# Altium project led-PCB_Project.PrjPcb
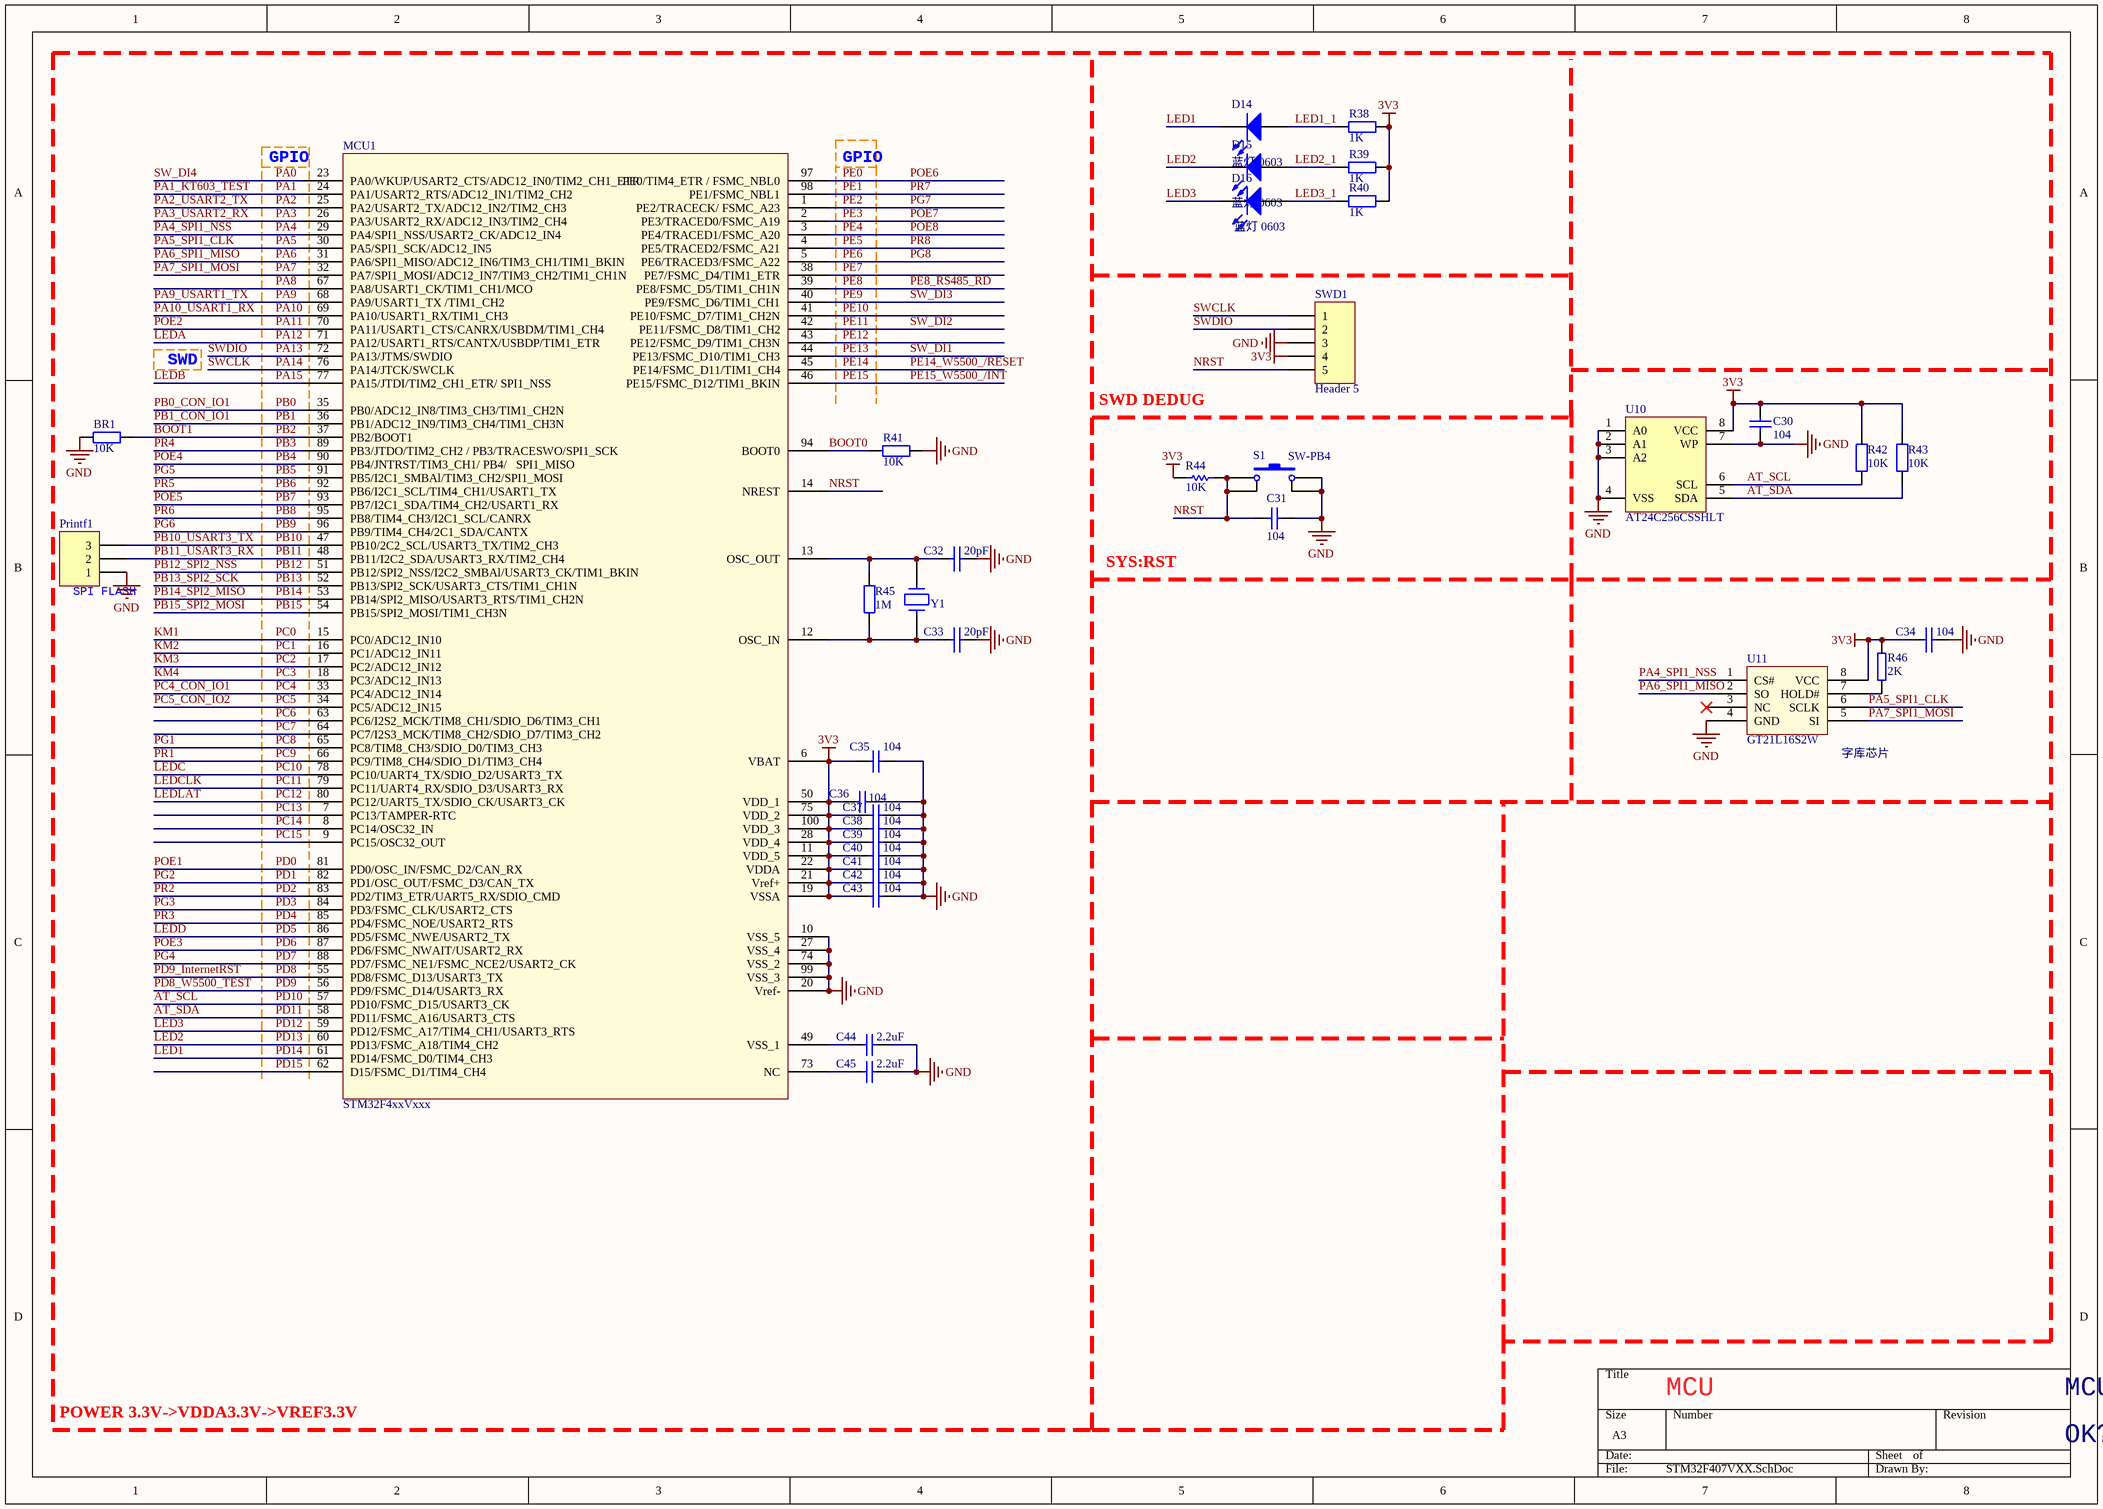
[diagram p0: STM32F407VXX.SchDoc]
8 sheets, 303 parts. Net scope: global (net labels, ports and power ports of the same name join across sheets).
Board file: LH_Traffic_Light(XP)_V2.2_20171103-1500pm.PcbDoc
Sheets:
  STM32F407VXX.SchDoc
  W5500.SchDoc
  FOUR-INPORT.SchDoc
  LED-12PORT.SchDoc
  RS485.SchDoc
  KT403A1.SchDoc
  TWO_OUTPORT.SchDoc
  POWER.SchDoc

## Sheet STM32F407VXX.SchDoc
size A3

### Parts
(Parts that share a designator on the sheet are numbered #1, #2 ... from top to bottom, then left to right.)
BR1  10K  [LC-0603_R]
C30  104  [LC-0603_C]
C31  104  [LC-0603_C]
C32  20pF  [LC-0603_C]
C33#1  20pF  [LC-0603_C]
C34  104  [LC-0603_C]
C35#1  104  [LC-0603_C]
C36#1  104  [LC-0603_C]
C37#1  104  [LC-0603_C]
C38  104  [LC-0603_C]
C39  104  [LC-0603_C]
C40  104  [LC-0603_C]
C41  104  [LC-0603_C]
C42  104  [LC-0603_C]
C43  104  [LC-0603_C]
C44  2.2uF  [LC-0603_C]
C45  2.2uF  [LC-0603_C]
D14  蓝灯 0603  [LC-0603_LED_S1]
D15  蓝灯 0603  [LC-0603_LED_S1]
D16  蓝灯 0603  [LC-0603_LED_S1]
MCU1  STM32F4xxVxxx  [LC-QFP-100_14x14x05P]
Printf1  Printf  [F2.54-3P]  (value not drawn)
R38#1  1K  [LC-0603_R]
R39  1K  [LC-0603_R]
R40  1K  [LC-0603_R]
R41  10K  [LC-0603_R]
R42  10K  [LC-0603_R]
R43  10K  [LC-0603_R]
R44  10K  [LC-0603_R]
R45  1M  [LC-0603_R]
R46  2K  [LC-0603_R]
S1  SW-PB4  [SW_PB4_A1]
SWD1  Header 5  [F2.54-5P]
U10  AT24C256CSSHLT  [SOIC-8]
U11  GT21L16S2W  [SOIC-8W]
Y1  25MHz  [LC-HC-49SMD]  (value not drawn)

### Nets
3V3: C30.1 C34.2 C35#1.1 C36#1.1 C37#1.1 C38.1 C39.1 C40.1 C41.1 C42.1 C43.1 MCU1.6(VBAT) MCU1.11(VDD_5) MCU1.19(VSSA) MCU1.21(Vref+) MCU1.22(VDDA) MCU1.28(VDD_4) MCU1.50(VDD_1) MCU1.75(VDD_2) MCU1.100(VDD_3) R38#1.1 R39.1 R40.1 R42.1 R43.1 R44.2 R46.1 SWD1.4 U10.8(VCC) U11.8(VCC)
GND: BR1.1 C30.2 C31.1 C32.2 C33#1.2 C34.1 C35#1.2 C36#1.2 C37#1.2 C38.2 C39.2 C40.2 C41.2 C42.2 C43.2 C44.2 C45.2 MCU1.10(VSS_5) MCU1.20(Vref-) MCU1.27(VSS_4) MCU1.74(VSS_2) MCU1.99(VSS_3) Printf1.1 R41.1 S1.2 S1.3 SWD1.3 U10.1(A0) U10.2(A1) U10.3(A2) U10.4(VSS) U10.7(WP) U11.4(GND)
AT_SCL: MCU1.57(PD10/FSMC_D15/USART3_CK) R42.2 U10.6(SCL)  [also labelled PD10]
AT_SDA: MCU1.58(PD11/FSMC_A16/USART3_CTS) R43.2 U10.5(SDA)  [also labelled PD11]
BOOT0: MCU1.94(BOOT0) R41.2
BOOT1: BR1.2 MCU1.37(PB2/BOOT1)  [also labelled PB2]
KM1: MCU1.15(PC0/ADC12_IN10)  [also labelled PC0]
KM2: MCU1.16(PC1/ADC12_IN11)  [also labelled PC1]
KM3: MCU1.17(PC2/ADC12_IN12)  [also labelled PC2]
KM4: MCU1.18(PC3/ADC12_IN13)  [also labelled PC3]
LED1: D14.K MCU1.61(PD14/FSMC_D0/TIM4_CH3)  [also labelled PD14]
LED1_1: D14.A R38#1.2
LED2: D15.K MCU1.60(PD13/FSMC_A18/TIM4_CH2)  [also labelled PD13]
LED2_1: D15.A R39.2
LED3: D16.K MCU1.59(PD12/FSMC_A17/TIM4_CH1/USART3_RTS)  [also labelled PD12]
LED3_1: D16.A R40.2
LEDA: MCU1.71(PA12/USART1_RTS/CANTX/USBDP/TIM1_ETR)  [also labelled PA12]
LEDB: MCU1.77(PA15/JTDI/TIM2_CH1_ETR/_SPI1_NSS)  [also labelled PA15]
LEDC: MCU1.78(PC10/UART4_TX/SDIO_D2/USART3_TX)  [also labelled PC10]
LEDCLK: MCU1.79(PC11/UART4_RX/SDIO_D3/USART3_RX)  [also labelled PC11]
LEDD: MCU1.86(PD5/FSMC_NWE/USART2_TX)  [also labelled PD5]
LEDLAT: MCU1.80(PC12/UART5_TX/SDIO_CK/USART3_CK)  [also labelled PC12]
NRST: C31.2 MCU1.14(NREST) R44.1 S1.1 S1.4 SWD1.5
PA0: MCU1.23(PA0/WKUP/USART2_CTS/ADC12_IN0/TIM2_CH1_ETR)  [also labelled SW_DI4]
PA1: MCU1.24(PA1/USART2_RTS/ADC12_IN1/TIM2_CH2)  [also labelled PA1_KT603_TEST]  [project net KT603_TEST]
PA2: MCU1.25(PA2/USART2_TX/ADC12_IN2/TIM2_CH3)  [also labelled PA2_USART2_TX]  [project net MP3_RX]
PA3: MCU1.26(PA3/USART2_RX/ADC12_IN3/TIM2_CH4)  [also labelled PA3_USART2_RX]  [project net MP3_TX]
PA4: MCU1.29(PA4/SPI1_NSS/USART2_CK/ADC12_IN4) U11.1(CS#)  [also labelled PA4_SPI1_NSS]
PA5: MCU1.30(PA5/SPI1_SCK/ADC12_IN5) U11.6(SCLK)  [also labelled PA5_SPI1_CLK]
PA6: MCU1.31(PA6/SPI1_MISO/ADC12_IN6/TIM3_CH1/TIM1_BKIN) U11.2(SO)  [also labelled PA6_SPI1_MISO]
PA7: MCU1.32(PA7/SPI1_MOSI/ADC12_IN7/TIM3_CH2/TIM1_CH1N) U11.5(SI)  [also labelled PA7_SPI1_MOSI]
PA8: MCU1.67(PA8/USART1_CK/TIM1_CH1/MCO)
PA9: MCU1.68(PA9/USART1_TX_/TIM1_CH2)  [also labelled PA9_USART1_TX]
PA10: MCU1.69(PA10/USART1_RX/TIM1_CH3)  [also labelled PA10_USART1_RX]
PA11: MCU1.70(PA11/USART1_CTS/CANRX/USBDM/TIM1_CH4)  [also labelled POE2]
PA13: MCU1.72(PA13/JTMS/SWDIO) SWD1.2  [also labelled SWDIO]
PA14: MCU1.76(PA14/JTCK/SWCLK) SWD1.1  [also labelled SWCLK]
PB0: MCU1.35(PB0/ADC12_IN8/TIM3_CH3/TIM1_CH2N)  [also labelled PB0_CON_IO1]  [project net CON_IO3]
PB1: MCU1.36(PB1/ADC12_IN9/TIM3_CH4/TIM1_CH3N)  [also labelled PB1_CON_IO1]  [project net CON_IO4]
PB3: MCU1.89(PB3/JTDO/TIM2_CH2_/_PB3/TRACESWO/SPI1_SCK)  [also labelled PR4]
PB4: MCU1.90(PB4/JNTRST/TIM3_CH1/_PB4/___SPI1_MISO)  [also labelled POE4]
PB5: MCU1.91(PB5/I2C1_SMBAl/TIM3_CH2/SPI1_MOSI)  [also labelled PG5]
PB6: MCU1.92(PB6/I2C1_SCL/TIM4_CH1/USART1_TX)  [also labelled PR5]
PB7: MCU1.93(PB7/I2C1_SDA/TIM4_CH2/USART1_RX)  [also labelled POE5]
PB8: MCU1.95(PB8/TIM4_CH3/I2C1_SCL/CANRX)  [also labelled PR6]
PB9: MCU1.96(PB9/TIM4_CH4/2C1_SDA/CANTX)  [also labelled PG6]
PB10: MCU1.47(PB10/2C2_SCL/USART3_TX/TIM2_CH3) Printf1.3  [also labelled PB10_USART3_TX]
PB11: MCU1.48(PB11/I2C2_SDA/USART3_RX/TIM2_CH4) Printf1.2  [also labelled PB11_USART3_RX]
PB12: MCU1.51(PB12/SPI2_NSS/I2C2_SMBAl/USART3_CK/TIM1_BKIN)  [also labelled PB12_SPI2_NSS]  [project net /SPI_SCS]
PB13: MCU1.52(PB13/SPI2_SCK/USART3_CTS/TIM1_CH1N)  [also labelled PB13_SPI2_SCK]
PB14: MCU1.53(PB14/SPI2_MISO/USART3_RTS/TIM1_CH2N)  [also labelled PB14_SPI2_MISO]
PB15: MCU1.54(PB15/SPI2_MOSI/TIM1_CH3N)  [also labelled PB15_SPI2_MOSI]
PC4: MCU1.33(PC4/ADC12_IN14)  [also labelled PC4_CON_IO1]  [project net CON_IO1]
PC5: MCU1.34(PC5/ADC12_IN15)  [also labelled PC5_CON_IO2]  [project net CON_IO2]
PC6: MCU1.63(PC6/I2S2_MCK/TIM8_CH1/SDIO_D6/TIM3_CH1)
PC7: MCU1.64(PC7/I2S3_MCK/TIM8_CH2/SDIO_D7/TIM3_CH2)
PC8: MCU1.65(PC8/TIM8_CH3/SDIO_D0/TIM3_CH3)  [also labelled PG1]
PC9: MCU1.66(PC9/TIM8_CH4/SDIO_D1/TIM3_CH4)  [also labelled PR1]
PC13: MCU1.7(PC13/TAMPER-RTC)
PC14: MCU1.8(PC14/OSC32_IN)
PC15: MCU1.9(PC15/OSC32_OUT)
PD0: MCU1.81(PD0/OSC_IN/FSMC_D2/CAN_RX)  [also labelled POE1]
PD1: MCU1.82(PD1/OSC_OUT/FSMC_D3/CAN_TX)  [also labelled PG2]
PD2: MCU1.83(PD2/TIM3_ETR/UART5_RX/SDIO_CMD)  [also labelled PR2]
PD3: MCU1.84(PD3/FSMC_CLK/USART2_CTS)  [also labelled PG3]
PD4: MCU1.85(PD4/FSMC_NOE/USART2_RTS)  [also labelled PR3]
PD6: MCU1.87(PD6/FSMC_NWAIT/USART2_RX)  [also labelled POE3]
PD7: MCU1.88(PD7/FSMC_NE1/FSMC_NCE2/USART2_CK)  [also labelled PG4]
PD8: MCU1.55(PD8/FSMC_D13/USART3_TX)  [also labelled PD9_InternetRST]  [project net InternetRST]
PD8_W5500_TEST: MCU1.56(PD9/FSMC_D14/USART3_RX)  [also labelled PD9]
PD15: MCU1.62(D15/FSMC_D1/TIM4_CH4)
PE0: MCU1.97(PE0/TIM4_ETR_/_FSMC_NBL0)  [also labelled POE6]
PE1: MCU1.98(PE1/FSMC_NBL1)  [also labelled PR7]
PE2: MCU1.1(PE2/TRACECK/_FSMC_A23)  [also labelled PG7]
PE3: MCU1.2(PE3/TRACED0/FSMC_A19)  [also labelled POE7]
PE4: MCU1.3(PE4/TRACED1/FSMC_A20)  [also labelled POE8]
PE5: MCU1.4(PE5/TRACED2/FSMC_A21)  [also labelled PR8]
PE6: MCU1.5(PE6/TRACED3/FSMC_A22)  [also labelled PG8]
PE7: MCU1.38(PE7/FSMC_D4/TIM1_ETR)
PE8: MCU1.39(PE8/FSMC_D5/TIM1_CH1N)  [also labelled PE8_RS485_RD]
PE9: MCU1.40(PE9/FSMC_D6/TIM1_CH1)  [also labelled SW_DI3]
PE10: MCU1.41(PE10/FSMC_D7/TIM1_CH2N)
PE11: MCU1.42(PE11/FSMC_D8/TIM1_CH2)  [also labelled SW_DI2]
PE12: MCU1.43(PE12/FSMC_D9/TIM1_CH3N)
PE13: MCU1.44(PE13/FSMC_D10/TIM1_CH3)  [also labelled SW_DI1]
PE14: MCU1.45(PE14/FSMC_D11/TIM1_CH4)  [also labelled PE14_W5500_/RESET]  [project net /RESET]
PE15: MCU1.46(PE15/FSMC_D12/TIM1_BKIN)  [also labelled PE15_W5500_/INT]  [project net /INT]
NetC32_1: C32.1 MCU1.13(OSC_OUT) R45.2 Y1.2
NetC33#1_1: C33#1.1 MCU1.12(OSC_IN) R45.1 Y1.1
NetC44_1: C44.1 MCU1.49(VSS_1)
NetC45_1: C45.1 MCU1.73(NC)
NetR46_2: R46.2 U11.7(HOLD#)

Not connected (* = marked no-connect by the designer): U11 3(NC)*

### Notes on the sheet
- (near MCU1) GPIO
- GPIO
- SWD
- SWD DEDUG
- SYS:RST
- (near Printf1) SPI FLASH
- (near U11) 字库芯片
- MCU
- MCU板
- POWER 3.3V->VDDA3.3V->VREF3.3V
- OK?V1.0.0

### Library data of the parts
BR1 R38#1 R39-R43 R45 = Res2: Resistor; Published: 8-Jun-2000; LatestRevisionDate: 17-Jul-2002; LatestRevisionNote: Re-released for DXP Platform.; PackageReference: AXIAL-0.4; Publisher: Altium Limited
  BR1 R41-R43: Value: 10K
  R38#1 R39 R40: Value: 1K
  R45: Value: 1M
C30 C31 C35#1 C36#1 C37#1 C38-C43 = CAP: Capacitor; Value: 100nF; Published: 8-Jun-2000; Revision: July-2002: Re-released for DXP Platform.; Publisher: Altium Limited
C32 C33#1 C44 C45 = CAP: Capacitor
  C44 C45: Published: 8-Jun-2000; Revision: July-2002: Re-released for DXP Platform.; Publisher: Altium Limited; Value: 2.2uF
C34 = C
D14-D16 = 0603 蓝灯: 发光二极管; ComponentLink1Description: 供应商链接; ComponentLink1URL: http://www.szlcsc.com/product/details_73150.html; Package: 0603; Supplier: LC; SuppliersPartNumber: C72041
MCU1 = STM32F103VET6
Printf1 = Header 3H: Header, 3-Pin, Right Angle; LatestRevisionDate: 17-Jul-2002; LatestRevisionNote: Re-released for DXP Platform.; Publisher: Altium Limited
R44 = res1: Resistor; Published: 8-Jun-2000; Revision: July-2002: Re-released for DXP Platform.; Publisher: Altium Limited; Value: 10K
R46 = RES2
S1 = SW-PB4: 微动开关; Published: 24-Mar-1999; LatestRevisionDate: 17-Jul-2002; LatestRevisionNote: Re-released for DXP Platform.; PackageReference: SPST-2; Publisher: Altium Limited
SWD1 = Header 5: Header, 5-Pin; LatestRevisionDate: 17-Jul-2002; LatestRevisionNote: Re-released for DXP Platform.; Publisher: Altium Limited
U10 = AT2: EEROM存储器
U11 = GT21L16S
Y1 = CRYSTAL

## Sheet W5500.SchDoc
size A4
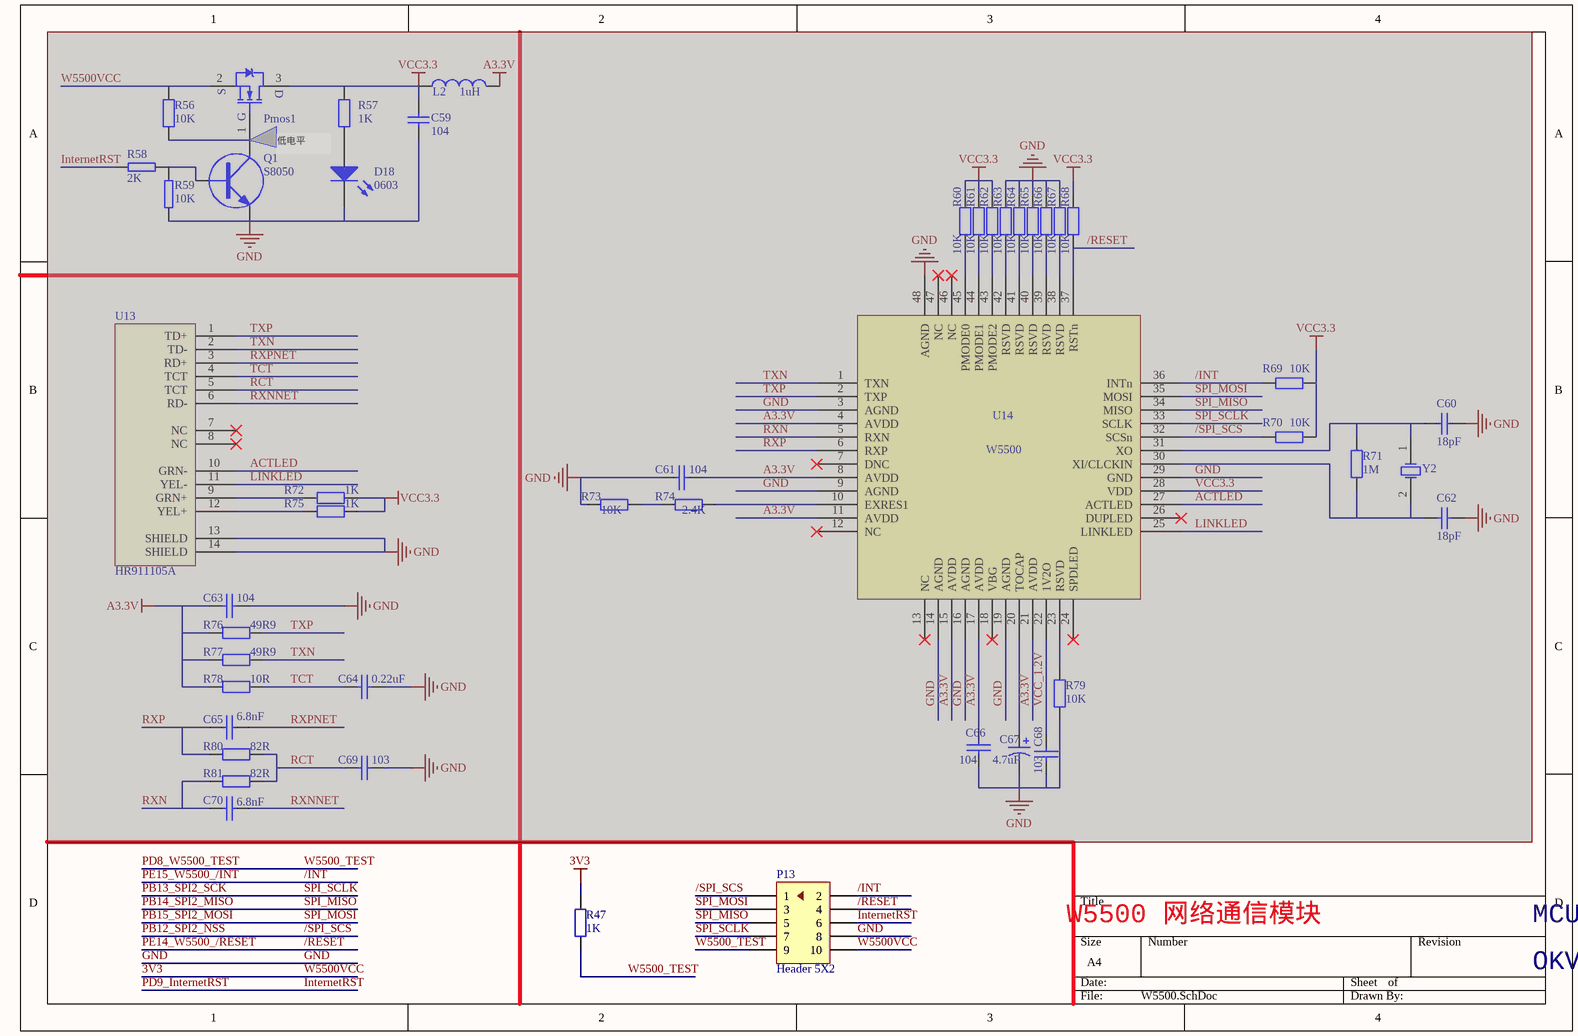
[diagram p1: W5500.SchDoc]

### Parts
(Parts that share a designator on the sheet are numbered #1, #2 ... from top to bottom, then left to right.)
C59  104  [LC-0603_C]  (masked out: inside a compile mask, not in the netlist)
C60  18pF  [LC-0603_C]  (masked out: inside a compile mask, not in the netlist)
C61  104  [LC-0603_C]  (masked out: inside a compile mask, not in the netlist)
C62  18pF  [LC-0603_C]  (masked out: inside a compile mask, not in the netlist)
C63  104  [LC-0603_C]  (masked out: inside a compile mask, not in the netlist)
C64  0.22uF  [LC-0603_C]  (masked out: inside a compile mask, not in the netlist)
C65  6.8nF  [LC-0603_C]  (masked out: inside a compile mask, not in the netlist)
C66  104  [LC-0603_C]  (masked out: inside a compile mask, not in the netlist)
C67  4.7uF  [LC-CASE-R_2012]  (masked out: inside a compile mask, not in the netlist)
C68  103  [LC-0603_C]  (masked out: inside a compile mask, not in the netlist)
C69  103  [LC-0603_C]  (masked out: inside a compile mask, not in the netlist)
C70  6.8nF  [LC-0603_C]  (masked out: inside a compile mask, not in the netlist)
D18#1  0603  [LC-0603_LED_S1]  (masked out: inside a compile mask, not in the netlist)
L2  1uH  [LC-0805_L]  (masked out: inside a compile mask, not in the netlist)
P13  Header 5X2  [HDR5X2-2.54]
Pmos1  SI2301  [LC-SOT-23(SOT-23-3)]  (value not drawn)  (masked out: inside a compile mask, not in the netlist)
Q1#1  S8050  [LC-SOT-23(SOT-23-3)]  (masked out: inside a compile mask, not in the netlist)
R47  1K  [R0603]
R56#1  10K  [LC-0603_R]  (masked out: inside a compile mask, not in the netlist)
R57#1  1K  [LC-0603_R]  (masked out: inside a compile mask, not in the netlist)
R58#1  2K  [LC-0603_R]  (masked out: inside a compile mask, not in the netlist)
R59#1  10K  [LC-0603_R]  (masked out: inside a compile mask, not in the netlist)
R60#1  10K  [LC-0603_R]  (masked out: inside a compile mask, not in the netlist)
R61#1  10K  [LC-0603_R]  (masked out: inside a compile mask, not in the netlist)
R62#1  10K  [LC-0603_R]  (masked out: inside a compile mask, not in the netlist)
R63#1  10K  [LC-0603_R]  (masked out: inside a compile mask, not in the netlist)
R64  10K  [LC-0603_R]  (masked out: inside a compile mask, not in the netlist)
R65  10K  [LC-0603_R]  (masked out: inside a compile mask, not in the netlist)
R66  10K  [LC-0603_R]  (masked out: inside a compile mask, not in the netlist)
R67  10K  [LC-0603_R]  (masked out: inside a compile mask, not in the netlist)
R68  10K  [LC-0603_R]  (masked out: inside a compile mask, not in the netlist)
R69  10K  [LC-0603_R]  (masked out: inside a compile mask, not in the netlist)
R70  10K  [LC-0603_R]  (masked out: inside a compile mask, not in the netlist)
R71  1M  [LC-0603_R]  (masked out: inside a compile mask, not in the netlist)
R72  1K  [LC-0603_R]  (masked out: inside a compile mask, not in the netlist)
R73  10K  [LC-0603_R]  (masked out: inside a compile mask, not in the netlist)
R74  2.4K  [LC-0603_R]  (masked out: inside a compile mask, not in the netlist)
R75  1K  [LC-0603_R]  (masked out: inside a compile mask, not in the netlist)
R76  49R9  [LC-0603_R]  (masked out: inside a compile mask, not in the netlist)
R77  49R9  [LC-0603_R]  (masked out: inside a compile mask, not in the netlist)
R78  10R  [LC-0603_R]  (masked out: inside a compile mask, not in the netlist)
R79  10K  [LC-0603_R]  (masked out: inside a compile mask, not in the netlist)
R80  82R  [LC-0603_R]  (masked out: inside a compile mask, not in the netlist)
R81  82R  [LC-0603_R]  (masked out: inside a compile mask, not in the netlist)
U13  HR911105A  [HR911105A]  (masked out: inside a compile mask, not in the netlist)
U14  W5500  [LQFP48]  (masked out: inside a compile mask, not in the netlist)
Y2  25MHz  [LC-HC-49SMD]  (value not drawn)  (masked out: inside a compile mask, not in the netlist)

### Nets
3V3: P13.10 R47.1  [also labelled W5500VCC]
GND: P13.8
/INT: P13.2  [also labelled PE15_W5500_/INT]
/RESET: P13.4  [also labelled PE14_W5500_/RESET]
/SPI_SCS: P13.1  [also labelled PB12_SPI2_NSS]
InternetRST: P13.6  [also labelled PD9_InternetRST]
PB13_SPI2_SCK: P13.7  [also labelled SPI_SCLK]  [project net PB13]
PB14_SPI2_MISO: P13.5  [also labelled SPI_MISO]  [project net PB14]
PB15_SPI2_MOSI: P13.3  [also labelled SPI_MOSI]  [project net PB15]
PD8_W5500_TEST: P13.9 R47.2  [also labelled W5500_TEST]

### Notes on the sheet
- 低电平
- W5500 网络通信模块
- MCU板
- OKV0.0.0

### Library data of the parts
C59 C60 C62 = Cap: Capacitor; Published: 8-Jun-2000; LatestRevisionDate: 17-Jul-2002; LatestRevisionNote: Re-released for DXP Platform.; PackageReference: RAD-0.3; Publisher: Altium Limited
  C59: Value: 104
  C60 C62: Value: 18pF
C61 C63-C66 C68-C70 = CAP: Capacitor
C67 = Cap Pol3: Polarized Capacitor (Surface Mount); Published: 8-Jun-2000; LatestRevisionDate: 17-Jul-2002; LatestRevisionNote: Re-released for DXP Platform.; PackageReference: C0805; Publisher: Altium Limited; Value: 4.7uF
D18#1 = 0: 发光二极管; ComponentLink1Description: 供应商链接; ComponentLink1URL: http://www.szlcsc.com/product/details_73150.html; Package: 0603; Supplier: LC; SuppliersPartNumber: C72041
L2 = Inductor: Code_IEC: 1005; Published: 8-Jun-2000; LatestRevisionDate: 17-Jul-2002; LatestRevisionNote: Re-released for DXP Platform.; PackageReference: 0402-A; Publisher: Altium Limited; Code_JEITA: 0402; Value: 1uH
P13 = Header 5X2: 接插件; LatestRevisionDate: 17-Jul-2002; LatestRevisionNote: Re-released for DXP Platform.; Publisher: Altium Limited
Pmos1 = N-MO
Q1#1 = NPN
R47 = Res2: Resistor; Value: 82R; Published: 8-Jun-2000; LatestRevisionDate: 17-Jul-2002; LatestRevisionNote: Re-released for DXP Platform.; PackageReference: AXIAL-0.4; Publisher: Altium Limited
R56#1 R57#1 R60#1 R61#1 R62#1 R63#1 R64-R72 R75 R78-R81 = Res2: Resistor; Published: 8-Jun-2000; LatestRevisionDate: 17-Jul-2002; LatestRevisionNote: Re-released for DXP Platform.; PackageReference: AXIAL-0.4; Publisher: Altium Limited
  R56#1 R60#1 R61#1 R62#1 R63#1 R64-R70 R79: Value: 10K
  R57#1 R72 R75: Value: 1K
  R71: Value: 1M
  R78: Value: 10R
  R80 R81: Value: 82R
R58#1 R59#1 = RES
R73 R74 = Res2: Resistor; Value: 12.4K 1%; Published: 8-Jun-2000; LatestRevisionDate: 17-Jul-2002; LatestRevisionNote: Re-released for DXP Platform.; PackageReference: AXIAL-0.4; Publisher: Altium Limited
R76 R77 = Res2: Resistor; Value: 49.9R; Published: 8-Jun-2000; LatestRevisionDate: 17-Jul-2002; LatestRevisionNote: Re-released for DXP Platform.; PackageReference: AXIAL-0.4; Publisher: Altium Limited
U14 = W: W5500以太网芯片
Y2 = XTAL: Crystal Oscillator; Published: 8-Jun-2000; LatestRevisionDate: 17-Jul-2002; LatestRevisionNote: Re-released for DXP Platform.; PackageReference: R38; Publisher: Altium Limited

## Sheet FOUR-INPORT.SchDoc
size A4
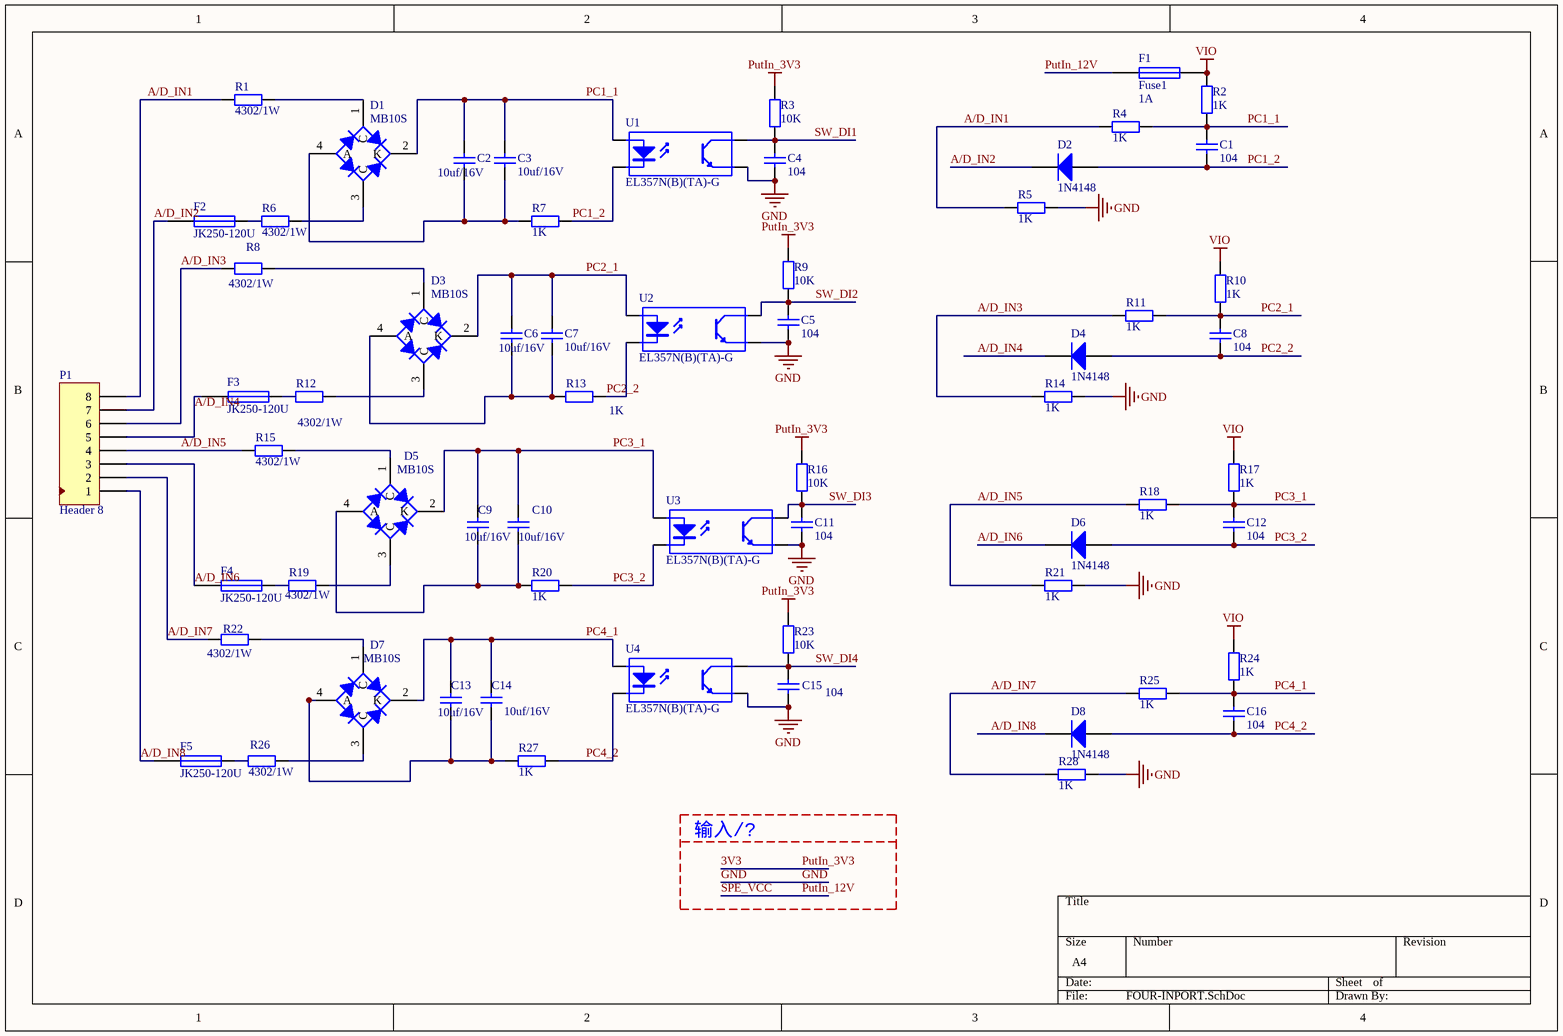
[diagram p2: FOUR-INPORT.SchDoc]

### Parts
(Parts that share a designator on the sheet are numbered #1, #2 ... from top to bottom, then left to right.)
C1  104  [LC-1206_C]
C2  10uf/16V  [LC-0805_C]
C3  10uf/16V  [LC-0805_C]
C4  104  [LC-0603_C]
C5  104  [LC-0603_C]
C6  10uf/16V  [LC-0805_C]
C7  10uf/16V  [LC-0805_C]
C8  104  [LC-1206_C]
C9  10uf/16V  [LC-0805_C]
C10  10uf/16V  [LC-0805_C]
C11#1  104  [LC-0603_C]
C12  104  [LC-1206_C]
C13  10uf/16V  [LC-0805_C]
C14  10uf/16V  [LC-0805_C]
C15  104  [LC-0603_C]
C16  104  [LC-1206_C]
D1  MB10S  [LC-MBS]
D2  1N4148  [LC-LL-34]
D3  MB10S  [LC-MBS]
D4  1N4148  [LC-LL-34]
D5#1  MB10S  [LC-MBS]
D6  1N4148  [LC-LL-34]
D7  MB10S  [LC-MBS]
D8  1N4148  [LC-LL-34]
F1  Fuse1  value 1A  [LC-1206_R]
F2  JK250-120U  [ntc250v]
F3  JK250-120U  [ntc250v]
F4  JK250-120U  [ntc250v]
F5  JK250-120U  [ntc250v]
P1  Header 8  [5.08-8p]
R1  4302/1W  [LC-2512_R]
R2  value 1K  [LC-1206_R]  (hidden comment: Res1)
R3  10K  [LC-0603_R]
R4  value 1K  [LC-1206_R]  (hidden comment: Res1)
R5  value 1K  [LC-1206_R]  (hidden comment: Res1)
R6  4302/1W  [LC-2512_R]
R7  1K  [LC-0603_R]
R8  4302/1W  [LC-2512_R]
R9  10K  [LC-0603_R]
R10  value 1K  [LC-1206_R]  (hidden comment: Res1)
R11  value 1K  [LC-1206_R]  (hidden comment: Res1)
R12#1  4302/1W  [LC-2512_R]
R13#1  1K  [LC-0603_R]
R14#1  value 1K  [LC-1206_R]  (hidden comment: Res1)
R15  4302/1W  [LC-2512_R]
R16  10K  [LC-0603_R]
R17  value 1K  [LC-1206_R]  (hidden comment: Res1)
R18  value 1K  [LC-1206_R]  (hidden comment: Res1)
R19  4302/1W  [LC-2512_R]
R20  1K  [LC-0603_R]
R21  value 1K  [LC-1206_R]  (hidden comment: Res1)
R22  4302/1W  [LC-2512_R]
R23  10K  [LC-0603_R]
R24  value 1K  [LC-1206_R]  (hidden comment: Res1)
R25  value 1K  [LC-1206_R]  (hidden comment: Res1)
R26  4302/1W  [LC-2512_R]
R27  1K  [LC-0603_R]
R28  value 1K  [LC-1206_R]  (hidden comment: Res1)
U1  EL357N(B)(TA)-G  [LC-SOP-4_P2.54]
U2  EL357N(B)(TA)-G  [LC-SOP-4_P2.54]
U3  EL357N(B)(TA)-G  [LC-SOP-4_P2.54]
U4  EL357N(B)(TA)-G  [LC-SOP-4_P2.54]

### Nets
3V3: R3.2 R9.2 R16.2 R23.2  [also labelled PutIn_3V3]
GND: C4.2 C5.2 C11#1.2 C15.2 R5.1 R14#1.1 R21.1 R28.1 U1.3(E) U2.3(E) U3.3(E) U4.3(E)
PutIn_12V: F1.1  [also labelled SPE_VCC]  [project net JZC_VCC]
VIO: F1.2 R2.2 R10.1 R17.1 R24.1
A/D_IN1: P1.8 R1.1 R4.2 R5.2
A/D_IN2: D2.2(K) F2.1 P1.7
A/D_IN3: P1.6 R8.1 R11.2 R14#1.2
A/D_IN4: D4.2(K) F3.1 P1.5
A/D_IN5: P1.4 R15.1 R18.2 R21.2
A/D_IN6: D6.2(K) F4.1 P1.3
A/D_IN7: P1.2 R22.1 R25.2 R28.2
A/D_IN8: D8.2(K) F5.1 P1.1
PC1_1: C1.1 C2.2 C3.2 D1.2(K) R2.1 R4.1 U1.1(A)
PC1_2: C1.2 D2.1(A) R7.1 U1.2(K)
PC2_1: C6.2 C7.2 C8.1 D3.2(K) R10.2 R11.1 U2.1(A)
PC2_2: C8.2 D4.1(A) R13#1.1 U2.2(K)
PC3_1: C9.2 C10.2 C12.1 D5#1.2(K) R17.2 R18.1 U3.1(A)
PC3_2: C12.2 D6.1(A) R20.1 U3.2(K)
PC4_1: C13.2 C14.2 C16.1 D7.2(K) R24.2 R25.1 U4.1(A)
PC4_2: C16.2 D8.1(A) R27.1 U4.2(K)
SW_DI1: C4.1 R3.1 U1.4(C)  [project net PE13]
SW_DI2: C5.1 R9.1 U2.4(C)  [project net PE11]
SW_DI3: C11#1.1 R16.1 U3.4(C)  [project net PE9]
SW_DI4: C15.1 R23.1 U4.4(C)  [project net PA0]
NetC2_1: C2.1 C3.1 D1.4(A) R7.2
NetC6_1: C6.1 C7.1 D3.4(A) R13#1.2
NetC9_1: C9.1 C10.1 D5#1.4(A) R20.2
NetC13_1: C13.1 C14.1 D7.4(A) R27.2
NetD1_1: D1.1(C) R1.2
NetD1_3: D1.3(C) R6.2
NetD3_1: D3.1(C) R8.2
NetD3_3: D3.3(C) R12#1.2
NetD5#1_1: D5#1.1(C) R15.2
NetD5#1_3: D5#1.3(C) R19.2
NetD7_1: D7.1(C) R22.2
NetD7_3: D7.3(C) R26.2
NetF2_2: F2.2 R6.1
NetF3_2: F3.2 R12#1.1
NetF4_2: F4.2 R19.1
NetF5_2: F5.2 R26.1

### Notes on the sheet
- 输入/?

### Library data of the parts
C1 C8 C12 C16 = Cap: Capacitor; Value: 100nF; Published: 8-Jun-2000; Revision: July-2002: Re-released for DXP Platform.; Publisher: Altium Limited
C2-C7 C9 C10 C11#1 C13-C15 = Cap: Capacitor; Value: 100pF; Published: 8-Jun-2000; LatestRevisionDate: 17-Jul-2002; LatestRevisionNote: Re-released for DXP Platform.; PackageReference: RAD-0.3; Publisher: Altium Limited; PackageDescription: Radial Cap, Thru-Hole; 2 Leads; 0.3 in Pin Spacing
D1 D3 D5#1 D7 = MBS MB1: 整流桥; ComponentLink1Description: 供应商链接; ComponentLink1URL: http://www.szlcsc.com/product/details_2865.html; Package: MBS; Supplier: LC; SuppliersPartNumber: C2488
D2 D4 D6 D8 = Diode: Default Diode; Published: 8-Jun-2000; LatestRevisionDate: 17-Jul-2002; LatestRevisionNote: Re-released for DXP Platform.; PackageDocument: Sep-1996; PackageReference: SMC; Publisher: Altium Limited; Code_JEDEC: DO-214-AB
F1 = Fus: 保险丝
F2-F5 = F: 保险丝; Value: 1A
P1 = Header: 接插件; LatestRevisionDate: 17-Jul-2002; LatestRevisionNote: Re-released for DXP Platform.; Publisher: Altium Limited
R1 R3 R6 R8 R9 R12#1 R15 R16 R19 R22 R23 R26 = Res2: Resistor; Value: 1K; Published: 8-Jun-2000; LatestRevisionDate: 17-Jul-2002; LatestRevisionNote: Re-released for DXP Platform.; PackageReference: AXIAL-0.4; Publisher: Altium Limited; PackageDescription: Axial Device, Thru-Hole; 2 Leads; 0.4 in Pin Spacing
R2 R4 R5 R10 R11 R14#1 R17 R18 R21 R24 R25 R28 = R: 贴片电阻; Published: 8-Jun-2000; LatestRevisionDate: 17-Jul-2002; LatestRevisionNote: Re-released for DXP Platform.; PackageReference: AXIAL-0.4; Publisher: Altium Limited
R7 R13#1 R20 R27 = Res2: Resistor; Published: 8-Jun-2000; LatestRevisionDate: 17-Jul-2002; LatestRevisionNote: Re-released for DXP Platform.; PackageReference: AXIAL-0.4; Publisher: Altium Limited; PackageDescription: Axial Device, Thru-Hole; 2 Leads; 0.4 in Pin Spacing; Value: 1K
U1-U4 = EL357N(B)(TA: 贴片光耦; ComponentLink1Description: 供应商链接; ComponentLink1URL: http://www.szlcsc.com/product/details_7114.html; Package: SOP-4_P2.54; Supplier: LC; SuppliersPartNumber: C6649

## Sheet LED-12PORT.SchDoc
size A4
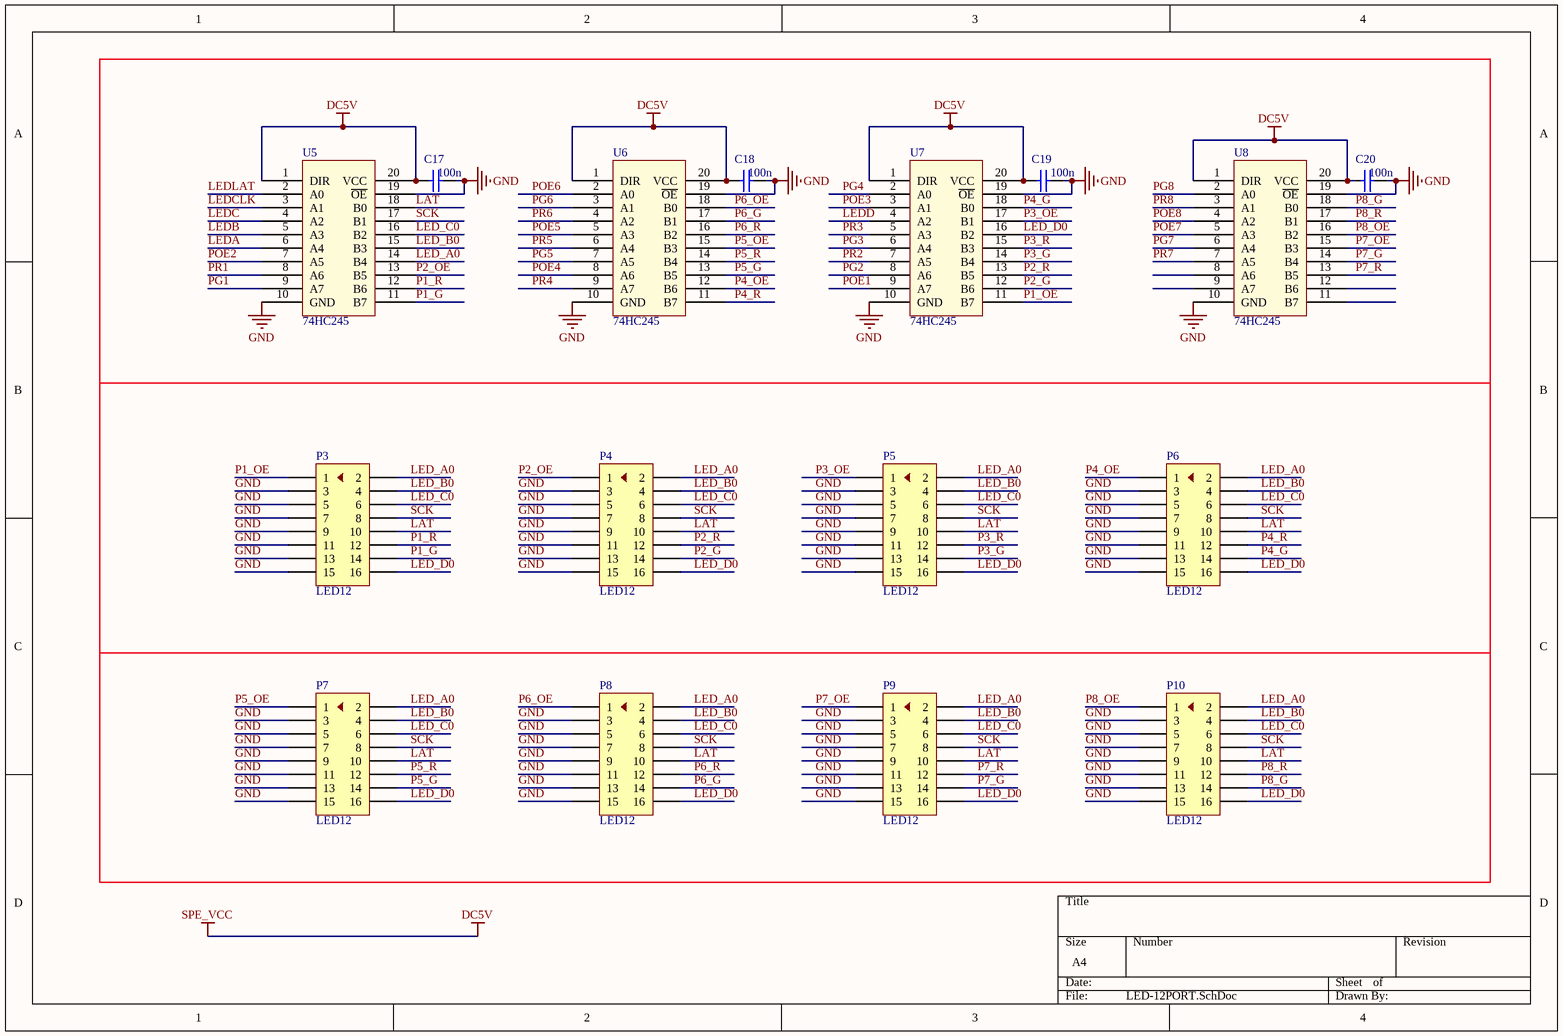
[diagram p3: LED-12PORT.SchDoc]

### Parts
(Parts that share a designator on the sheet are numbered #1, #2 ... from top to bottom, then left to right.)
C17#1  value 100n  [LC-0603_C]  (hidden comment: 104)
C18#1  value 100n  [LC-0603_C]  (hidden comment: 104)
C19#1  value 100n  [LC-0603_C]  (hidden comment: 104)
C20#1  value 100n  [LC-0603_C]  (hidden comment: 104)
P3#1  LED12  [DC3-16P-2.54mm]
P4  LED12  [DC3-16P-2.54mm]
P5  LED12  [DC3-16P-2.54mm]
P6  LED12  [DC3-16P-2.54mm]
P7  LED12  [DC3-16P-2.54mm]
P8  LED12  [DC3-16P-2.54mm]
P9  LED12  [DC3-16P-2.54mm]
P10  LED12  [DC3-16P-2.54mm]
U5#1  74HC245  [TSSOP-20]
U6  74HC245  [TSSOP-20]
U7  74HC245  [TSSOP-20]
U8  74HC245  [TSSOP-20]

### Nets
DC5V: C17#1.2 C18#1.2 C19#1.2 C20#1.2 U5#1.1(DIR) U5#1.20(VCC) U6.1(DIR) U6.20(VCC) U7.1(DIR) U7.20(VCC) U8.1(DIR) U8.20(VCC)  [also labelled SPE_VCC]  [project net JZC_VCC]
GND: C17#1.1 C18#1.1 C19#1.1 C20#1.1 P3#1.3 P3#1.5 P3#1.7 P3#1.9 P3#1.11 P3#1.13 P3#1.15 P4.3 P4.5 P4.7 P4.9 P4.11 P4.13 P4.15 P5.3 P5.5 P5.7 P5.9 P5.11 P5.13 P5.15 P6.3 P6.5 P6.7 P6.9 P6.11 P6.13 P6.15 P7.3 P7.5 P7.7 P7.9 P7.11 P7.13 P7.15 P8.3 P8.5 P8.7 P8.9 P8.11 P8.13 P8.15 P9.3 P9.5 P9.7 P9.9 P9.11 P9.13 P9.15 P10.3 P10.5 P10.7 P10.9 P10.11 P10.13 P10.15 U5#1.10(GND) U5#1.19(~{OE}) U6.10(GND) U6.19(~{OE}) U7.10(GND) U7.19(~{OE}) U8.10(GND) U8.19(~{OE})
LAT: P3#1.10 P4.10 P5.10 P6.10 P7.10 P8.10 P9.10 P10.10 U5#1.18(B0)
LED_A0: P3#1.2 P4.2 P5.2 P6.2 P7.2 P8.2 P9.2 P10.2 U5#1.14(B4)
LED_B0: P3#1.4 P4.4 P5.4 P6.4 P7.4 P8.4 P9.4 P10.4 U5#1.15(B3)
LED_C0: P3#1.6 P4.6 P5.6 P6.6 P7.6 P8.6 P9.6 P10.6 U5#1.16(B2)
LED_D0: P3#1.16 P4.16 P5.16 P6.16 P7.16 P8.16 P9.16 P10.16 U7.16(B2)
LEDA: U5#1.6(A4)
LEDB: U5#1.5(A3)
LEDC: U5#1.4(A2)
LEDCLK: U5#1.3(A1)
LEDD: U7.4(A2)
LEDLAT: U5#1.2(A0)
P1_G: P3#1.14 U5#1.11(B7)
P1_OE: P3#1.1 U7.11(B7)
P1_R: P3#1.12 U5#1.12(B6)
P2_G: P4.14 U7.12(B6)
P2_OE: P4.1 U5#1.13(B5)
P2_R: P4.12 U7.13(B5)
P3_G: P5.14 U7.14(B4)
P3_OE: P5.1 U7.17(B1)
P3_R: P5.12 U7.15(B3)
P4_G: P6.14 U7.18(B0)
P4_OE: P6.1 U6.12(B6)
P4_R: P6.12 U6.11(B7)
P5_G: P7.14 U6.13(B5)
P5_OE: P7.1 U6.15(B3)
P5_R: P7.12 U6.14(B4)
P6_G: P8.14 U6.17(B1)
P6_OE: P8.1 U6.18(B0)
P6_R: P8.12 U6.16(B2)
P7_G: P9.14 U8.14(B4)
P7_OE: P9.1 U8.15(B3)
P7_R: P9.12 U8.13(B5)
P8_G: P10.14 U8.18(B0)
P8_OE: P10.1 U8.16(B2)
P8_R: P10.12 U8.17(B1)
PG1: U5#1.9(A7)  [project net PC8]
PG2: U7.8(A6)  [project net PD1]
PG3: U7.6(A4)  [project net PD3]
PG4: U7.2(A0)  [project net PD7]
PG5: U6.7(A5)  [project net PB5]
PG6: U6.3(A1)  [project net PB9]
PG7: U8.6(A4)  [project net PE2]
PG8: U8.2(A0)  [project net PE6]
POE1: U7.9(A7)  [project net PD0]
POE2: U5#1.7(A5)  [project net PA11]
POE3: U7.3(A1)  [project net PD6]
POE4: U6.8(A6)  [project net PB4]
POE5: U6.5(A3)  [project net PB7]
POE6: U6.2(A0)  [project net PE0]
POE7: U8.5(A3)  [project net PE3]
POE8: U8.4(A2)  [project net PE4]
PR1: U5#1.8(A6)  [project net PC9]
PR2: U7.7(A5)  [project net PD2]
PR3: U7.5(A3)  [project net PD4]
PR4: U6.9(A7)  [project net PB3]
PR5: U6.6(A4)  [project net PB6]
PR6: U6.4(A2)  [project net PB8]
PR7: U8.7(A5)  [project net PE1]
PR8: U8.3(A1)  [project net PE5]
SCK: P3#1.8 P4.8 P5.8 P6.8 P7.8 P8.8 P9.8 P10.8 U5#1.17(B1)

Not connected (* = marked no-connect by the designer): U8 8(A6) 9(A7) 11(B7) 12(B6)

### Library data of the parts
C17#1 C18#1 C19#1 C20#1 = Cap: Capacitor; Published: 8-Jun-2000; LatestRevisionDate: 17-Jul-2002; LatestRevisionNote: Re-released for DXP Platform.; PackageReference: RAD-0.3; Publisher: Altium Limited
P3#1 P4-P10 = Header 8: 接插件; LatestRevisionDate: 17-Jul-2002; LatestRevisionNote: Re-released for DXP Platform.; Publisher: Altium Limited

## Sheet RS485.SchDoc
size A4
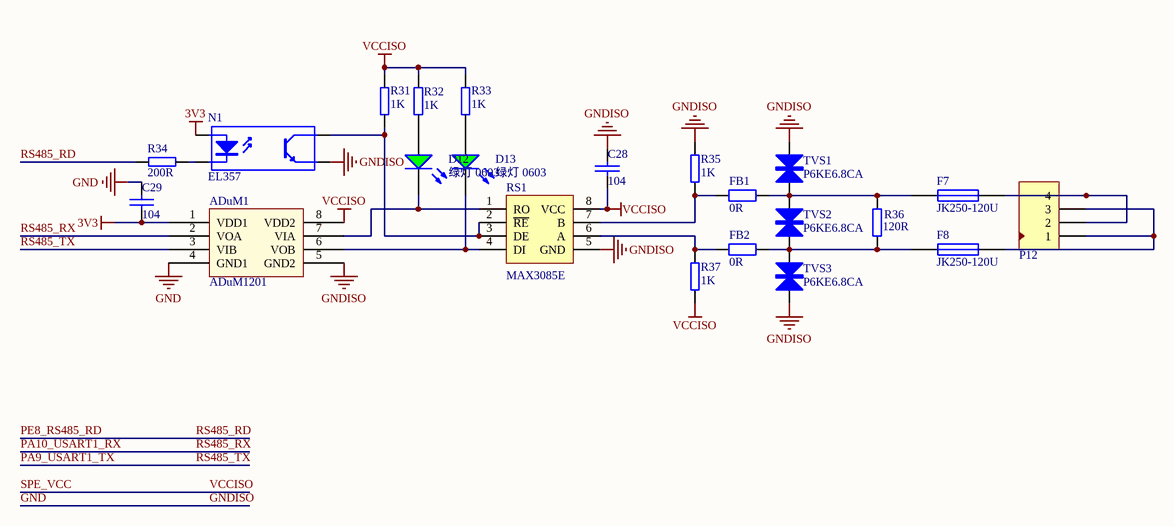
[diagram p4: RS485.SchDoc]

### Parts
(Parts that share a designator on the sheet are numbered #1, #2 ... from top to bottom, then left to right.)
ADuM1  ADuM1201  [SOIC-8]
C28#1  104  [LC-0603_C]
C29#1  104  [LC-0603_C]
D12  绿灯 0603  [LC-0603_LED_S1]
D13  绿灯 0603  [LC-0603_LED_S1]
F7  JK250-120U  [ntc250v]
F8  JK250-120U  [ntc250v]
FB1  0R  [LC-0603_L]
FB2  0R  [LC-0603_L]
N1  EL357  [lc-sop-4_P2.54]
P12  Header 4  [5.08-4P]  (value not drawn)
R31#1  1K  [LC-0603_R]
R32#1  1K  [LC-0603_R]
R33#1  1K  [LC-0603_R]
R34#1  200R  [LC-0603_R]
R35#1  1K  [LC-0603_R]
R36#1  120R  [LC-0603_R]
R37#1  1K  [LC-0603_R]
RS1  MAX3085E  [SOIC-8]
TVS1  P6KE6.8CA  [TVS]
TVS2  P6KE6.8CA  [TVS]
TVS3  P6KE6.8CA  [TVS]

### Nets
3V3: ADuM1.1(VDD1) C29#1.2 N1.1(A)
GND: ADuM1.4(GND1) ADuM1.5(GND2) C28#1.1 C29#1.1 N1.3(E) R35#1.1 RS1.5(GND) TVS1.2 TVS3.1  [also labelled GNDISO]
SPE_VCC: ADuM1.8(VDD2) C28#1.2 R31#1.1 R32#1.2 R33#1.1 R37#1.2 RS1.8(VCC)  [also labelled VCCISO]  [project net JZC_VCC]
PA9_USART1_TX: ADuM1.3(VIB)  [also labelled RS485_TX]  [project net PA9]
PA10_USART1_RX: ADuM1.2(VOA)  [also labelled RS485_RX]  [project net PA10]
PE8_RS485_RD: R34#1.1  [also labelled RS485_RD]  [project net PE8]
NetADuM1_6: ADuM1.6(VOB) D13.K RS1.4(DI)
NetADuM1_7: ADuM1.7(VIA) D12.K RS1.1(RO)
NetD12_A: D12.A R32#1.1
NetD13_A: D13.A R33#1.2
NetF7_1: F7.1 FB1.1 R36#1.2 TVS1.1 TVS2.2
NetF7_2: F7.2 P12.2 P12.4
NetF8_1: F8.1 FB2.1 R36#1.1 TVS2.1 TVS3.2
NetF8_2: F8.2 P12.1 P12.3
NetFB1_2: FB1.2 R35#1.2 RS1.7(B)
NetFB2_2: FB2.2 R37#1.1 RS1.6(A)
NetN1_2: N1.2(K) R34#1.2
NetN1_4: N1.4(C) R31#1.2 RS1.2(~{RE}) RS1.3(DE)

### Library data of the parts
C28#1 C29#1 = CAP
D12 D13 = 0603 绿灯: 发光二极管; ComponentLink1Description: 供应商链接; ComponentLink1URL: http://www.szlcsc.com/product/details_73152.html; Package: 0603; Supplier: LC; SuppliersPartNumber: C72043
F7 F8 = Fus: 保险丝; Value: 1A
FB1 FB2 = Res2: Resistor; Published: 8-Jun-2000; LatestRevisionDate: 17-Jul-2002; LatestRevisionNote: Re-released for DXP Platform.; PackageReference: AXIAL-0.4; Publisher: Altium Limited; Value: 0R
N1 = ST188: 反射式光电传感器; Published: 24-Mar-1999; LatestRevisionDate: 04-Mar-2005; LatestRevisionNote: Sch pins 3 & 4 Swapped.; DatasheetDocument: Nov-2003; PackageReference: DIP-4; Publisher: Altium Limited
P12 = Header 4: 接插件; LatestRevisionDate: 17-Jul-2002; LatestRevisionNote: Re-released for DXP Platform.; Publisher: Altium Limited
R31#1 R32#1 R33#1 R34#1 = RES2
R35#1 R36#1 R37#1 = RES
TVS1-TVS3 = TVS

## Sheet KT403A1.SchDoc
size A4
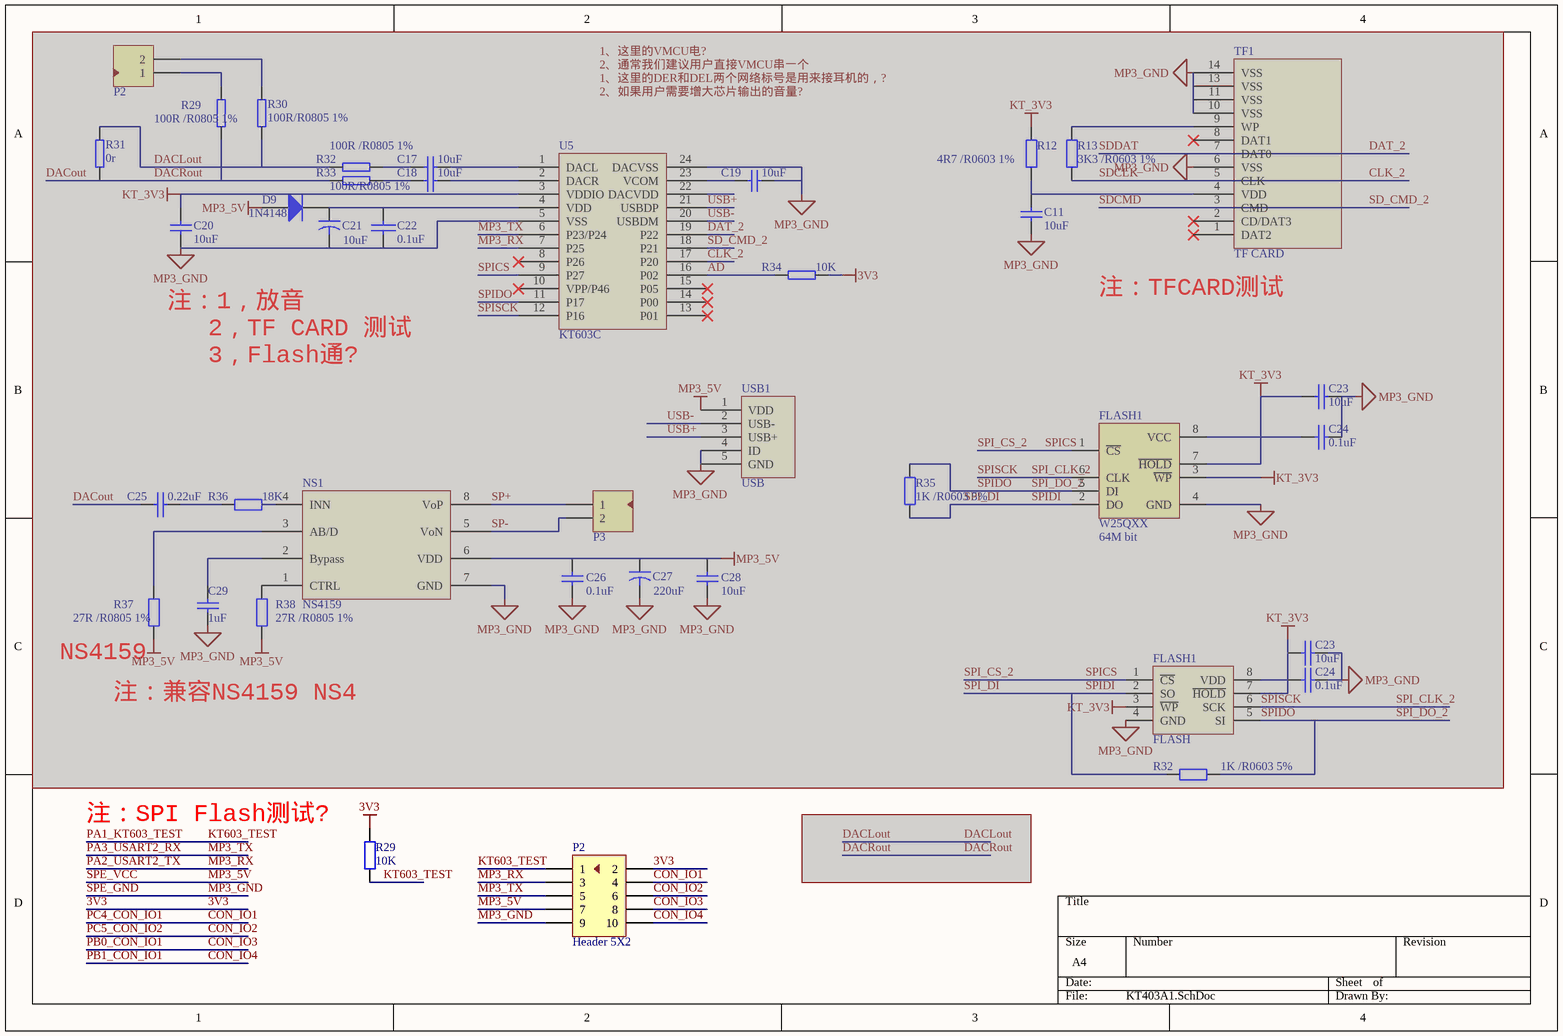
[diagram p5: KT403A1.SchDoc]

### Parts
(Parts that share a designator on the sheet are numbered #1, #2 ... from top to bottom, then left to right.)
C11#2  10uF  [C0805]  (masked out: inside a compile mask, not in the netlist)
C17#2  10uF  [LC-0603_C]  (masked out: inside a compile mask, not in the netlist)
C18#2  10uF  [LC-0603_C]  (masked out: inside a compile mask, not in the netlist)
C19#2  10uF  [LC-0805_C]  (masked out: inside a compile mask, not in the netlist)
C20#2  10uF  [LC-0603_C]  (masked out: inside a compile mask, not in the netlist)
C21#1  10uF  [LC-0603_C]  (masked out: inside a compile mask, not in the netlist)
C22#1  0.1uF  [LC-0603_C]  (masked out: inside a compile mask, not in the netlist)
C23#1  10uF  [LC-0603_C]  (masked out: inside a compile mask, not in the netlist)
C23#2  10uF  [LC-0603_C]  (masked out: inside a compile mask, not in the netlist)
C24#1  0.1uF  [LC-0603_C]  (masked out: inside a compile mask, not in the netlist)
C24#2  0.1uF  [LC-0603_C]  (masked out: inside a compile mask, not in the netlist)
C25#1  0.22uF  [LC-0805_C]  (masked out: inside a compile mask, not in the netlist)
C26#1  0.1uF  [LC-0603_C]  (masked out: inside a compile mask, not in the netlist)
C27#1  value 220uF  [HONOR_63X54]  (hidden comment: 220uF/16V)  (masked out: inside a compile mask, not in the netlist)
C28#2  10uF  [LC-0805_C]  (masked out: inside a compile mask, not in the netlist)
C29#2  1uF  [LC-0603_C]  (masked out: inside a compile mask, not in the netlist)
D9#1  1N4148  [1N4148]  (masked out: inside a compile mask, not in the netlist)
FLASH1#1  W25QXX  Memory: 64M bit  [SOIC-8W]  (masked out: inside a compile mask, not in the netlist)
FLASH1#2  FLASH  [SOIC-8W]  (masked out: inside a compile mask, not in the netlist)
NS1  NS4159  [SOIC8]  (masked out: inside a compile mask, not in the netlist)
P2#1  Header 2  [KF2.54-2P]  (value not drawn)  (masked out: inside a compile mask, not in the netlist)
P2#2  Header 5X2  [HDR5X2-2.54]
P3#2  Header 2  [KF2.54-2P]  (value not drawn)  (masked out: inside a compile mask, not in the netlist)
R12#2  4R7 /R0603 1%  [R0603]  (masked out: inside a compile mask, not in the netlist)
R13#2  3K3 /R0603 1%  [R0603]  (masked out: inside a compile mask, not in the netlist)
R29#1  100R /R0805 1%  [LC-0603_R]  (masked out: inside a compile mask, not in the netlist)
R29#2  10K  [LC-0603_R]
R30#1  100R/R0805 1%  [LC-0603_R]  (masked out: inside a compile mask, not in the netlist)
R31#2  0r  [LC-0603_R]  (masked out: inside a compile mask, not in the netlist)
R32#2  100R /R0805 1%  [LC-0603_R]  (masked out: inside a compile mask, not in the netlist)
R32#3  1K /R0603 5%  [0603-1]  (masked out: inside a compile mask, not in the netlist)
R33#2  100R/R0805 1%  [LC-0603_R]  (masked out: inside a compile mask, not in the netlist)
R34#2  10K  [R0603]  (masked out: inside a compile mask, not in the netlist)
R35#2  1K /R0603 5%  [0603-1]  (masked out: inside a compile mask, not in the netlist)
R36#2  18K  [LC-0603_R]  (masked out: inside a compile mask, not in the netlist)
R37#2  27R /R0805 1%  [LC-0603_R]  (masked out: inside a compile mask, not in the netlist)
R38#2  27R /R0805 1%  [LC-0603_R]  (masked out: inside a compile mask, not in the netlist)
TF1  TF CARD  [TF_ZT]  (masked out: inside a compile mask, not in the netlist)
U5#2  KT603C  [SSOP24]  (masked out: inside a compile mask, not in the netlist)
USB1  USB  [USB_MK5]  (masked out: inside a compile mask, not in the netlist)

### Nets
3V3: P2#2.2 R29#2.1
MP3_5V: P2#2.7  [also labelled SPE_VCC]  [project net JZC_VCC]
MP3_GND: P2#2.9  [also labelled SPE_GND]  [project net GND]
CON_IO1: P2#2.4  [also labelled PC4_CON_IO1]
CON_IO2: P2#2.6  [also labelled PC5_CON_IO2]
CON_IO3: P2#2.8  [also labelled PB0_CON_IO1]
CON_IO4: P2#2.10  [also labelled PB1_CON_IO1]
KT603_TEST: P2#2.1 R29#2.2  [also labelled PA1_KT603_TEST]
MP3_RX: P2#2.3  [also labelled PA2_USART2_TX]
MP3_TX: P2#2.5  [also labelled PA3_USART2_RX]

### Notes on the sheet
- 注：1，放音
- (near TF1) 注：TFCARD测试
- 2，TF CARD 测试
- 3，Flash通?
- (near R37#2) NS4159
- 注：兼容NS4159 NS4
- 注：SPI Flash测试?

### Library data of the parts
C11#2 C17#2 C18#2 C20#2 C26#1 C28#2 C29#2 = Cap: Capacitor; Published: 8-Jun-2000; Revision: July-2002: Re-released for DXP Platform.; Publisher: Altium Limited
  C11#2 C17#2 C18#2 C20#2 C28#2: Value: 10uF
  C26#1: Value: 0.1uF
  C29#2: Value: 1uF
C19#2 = Cap: Capacitor; Value: 1uF; Published: 8-Jun-2000; Revision: July-2002: Re-released for DXP Platform.; Publisher: Altium Limited
C21#1 C27#1 = Cap2: Capacitor; Published: 23-Sep-2002; PackageReference: CAPR5-4X5; Publisher: Altium Limited
  C21#1: Value: 10uF
C22#1 C23#1 C23#2 C24#1 C24#2 C25#1 = C
D9#1 = Diode: Default Diode; Published: 8-Jun-2000; LatestRevisionDate: 17-Jul-2002; LatestRevisionNote: Re-released for DXP Platform.; PackageDocument: Sep-1996; PackageReference: SMC; Publisher: Altium Limited; Code_JEDEC: DO-214-AB
FLASH1#1 = W25QXX: SPI FLASH
FLASH1#2 = SPI FLASH
P2#1 P3#2 = Header: 接插件; LatestRevisionDate: 17-Jul-2002; LatestRevisionNote: Re-released for DXP Platform.; Publisher: Altium Limited
P2#2 = Header 5X2: 接插件; LatestRevisionDate: 17-Jul-2002; LatestRevisionNote: Re-released for DXP Platform.; Publisher: Altium Limited
R12#2 R13#2 R32#3 R35#2 R36#2 R37#2 R38#2 = Res2: Resistor; Published: 8-Jun-2000; LatestRevisionDate: 17-Jul-2002; LatestRevisionNote: Re-released for DXP Platform.; PackageReference: AXIAL-0.4; Publisher: Altium Limited
  R12#2: Value: 4R7
  R13#2: Value: 3K3
  R32#3 R35#2: Value: 1K
  R36#2: Value: 18K
  R37#2 R38#2: Value: 27R
R29#1 R30#1 R31#2 R32#2 R33#2 R34#2 = RES2
R29#2 = Res2: Resistor; Value: 18K; Published: 8-Jun-2000; LatestRevisionDate: 17-Jul-2002; LatestRevisionNote: Re-released for DXP Platform.; PackageReference: AXIAL-0.4; Publisher: Altium Limited
U5#2 = AC24-TTS

## Sheet TWO_OUTPORT.SchDoc
size A3
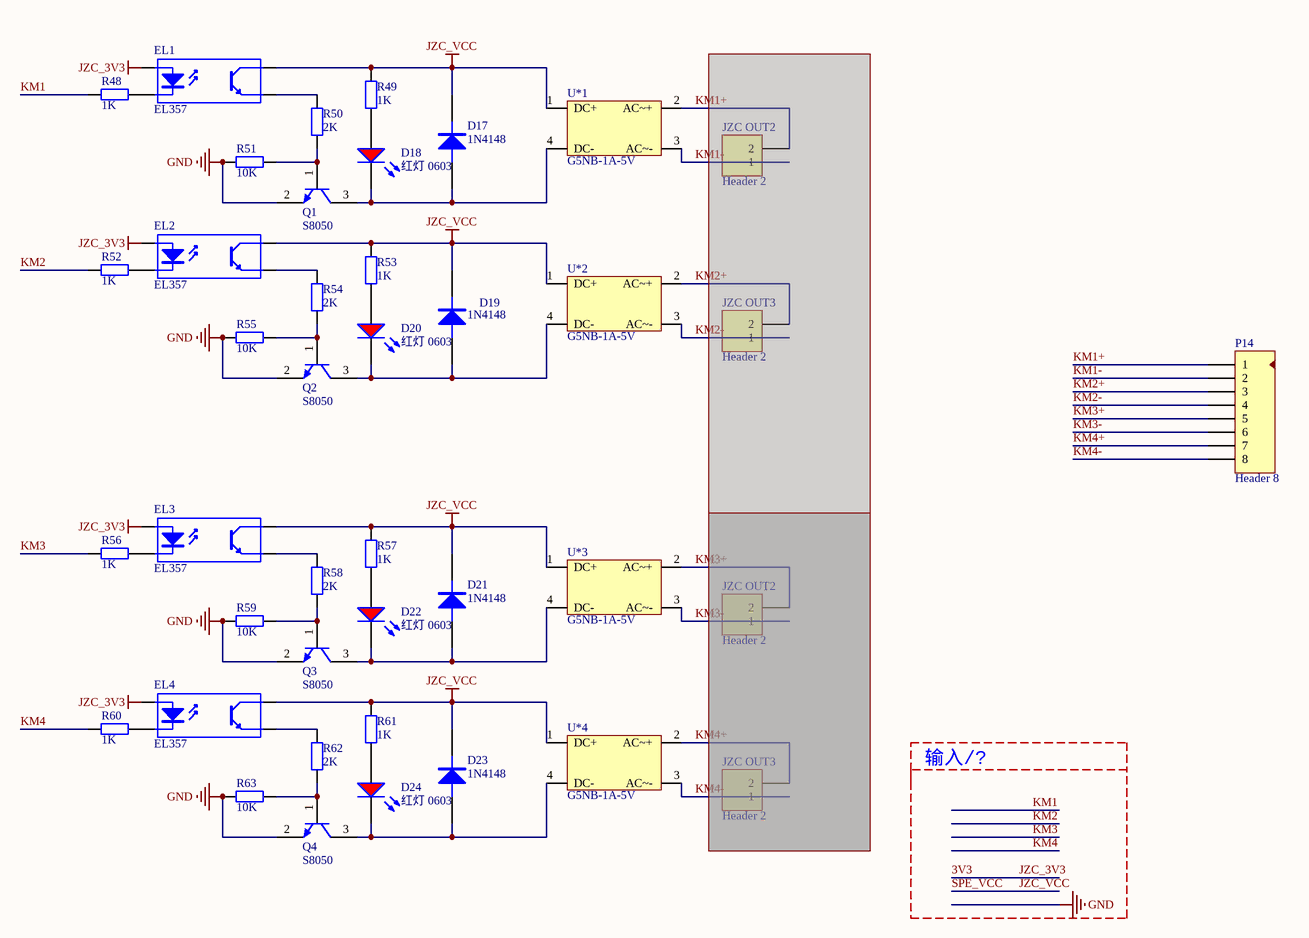
[diagram p6: TWO_OUTPORT.SchDoc]

### Parts
(Parts that share a designator on the sheet are numbered #1, #2 ... from top to bottom, then left to right.)
D17  1N4148  [LC-LL-34]
D18#2  红灯 0603  [LC-0603_LED_S1]
D19  1N4148  [LC-LL-34]
D20  红灯 0603  [LC-0603_LED_S1]
D21  1N4148  [LC-LL-34]
D22  红灯 0603  [LC-0603_LED_S1]
D23  1N4148  [LC-LL-34]
D24  红灯 0603  [LC-0603_LED_S1]
EL1  EL357  [lc-sop-4_P2.54]
EL2  EL357  [lc-sop-4_P2.54]
EL3  EL357  [lc-sop-4_P2.54]
EL4  EL357  [lc-sop-4_P2.54]
JZC_OUT2#1  Header 2  [D5.08-2P]  (masked out: inside a compile mask, not in the netlist)
JZC_OUT2#2  Header 2  [D5.08-2P]  (masked out: inside a compile mask, not in the netlist)
JZC_OUT3#1  Header 2  [D5.08-2P]  (masked out: inside a compile mask, not in the netlist)
JZC_OUT3#2  Header 2  [D5.08-2P]  (masked out: inside a compile mask, not in the netlist)
P14  Header 8  [5.08-8p]
Q1#2  S8050  [LC-SOT-23(SOT-23-3)]
Q2  S8050  [LC-SOT-23(SOT-23-3)]
Q3  S8050  [LC-SOT-23(SOT-23-3)]
Q4  S8050  [LC-SOT-23(SOT-23-3)]
R48  1K  [LC-0603_R]
R49  1K  [LC-0603_R]
R50  2K  [LC-0603_R]
R51  10K  [LC-0603_R]
R52  1K  [LC-0603_R]
R53  1K  [LC-0603_R]
R54  2K  [LC-0603_R]
R55  10K  [LC-0603_R]
R56#2  1K  [LC-0603_R]
R57#2  1K  [LC-0603_R]
R58#2  2K  [LC-0603_R]
R59#2  10K  [LC-0603_R]
R60#2  1K  [LC-0603_R]
R61#2  1K  [LC-0603_R]
R62#2  2K  [LC-0603_R]
R63#2  10K  [LC-0603_R]
U*1  G5NB-1A-5V  [G5NB-1A-5V]
U*2  G5NB-1A-5V  [G5NB-1A-5V]
U*3  G5NB-1A-5V  [G5NB-1A-5V]
U*4  G5NB-1A-5V  [G5NB-1A-5V]

### Nets
3V3: EL1.1(A) EL2.1(A) EL3.1(A) EL4.1(A)  [also labelled JZC_3V3]
GND: Q1#2.2(E) Q2.2(E) Q3.2(E) Q4.2(E) R51.2 R55.2 R59#2.2 R63#2.2
JZC_VCC: D17.2(K) D19.2(K) D21.2(K) D23.2(K) EL1.4(C) EL2.4(C) EL3.4(C) EL4.4(C) R49.1 R53.1 R57#2.1 R61#2.1 U*1.1(DC+) U*2.1(DC+) U*3.1(DC+) U*4.1(DC+)  [also labelled SPE_VCC]
KM1: R48.2
KM1+: P14.1 U*1.2(AC~+)
KM1-: P14.2 U*1.3(AC~-)
KM2: R52.2
KM2+: P14.3 U*2.2(AC~+)
KM2-: P14.4 U*2.3(AC~-)
KM3: R56#2.2
KM3+: P14.5 U*3.2(AC~+)
KM3-: P14.6 U*3.3(AC~-)
KM4: R60#2.2
KM4+: P14.7 U*4.2(AC~+)
KM4-: P14.8 U*4.3(AC~-)
NetD17_1: D17.1(A) D18#2.K Q1#2.3(C) U*1.4(DC-)
NetD18#2_A: D18#2.A R49.2
NetD19_1: D19.1(A) D20.K Q2.3(C) U*2.4(DC-)
NetD20_A: D20.A R53.2
NetD21_1: D21.1(A) D22.K Q3.3(C) U*3.4(DC-)
NetD22_A: D22.A R57#2.2
NetD23_1: D23.1(A) D24.K Q4.3(C) U*4.4(DC-)
NetD24_A: D24.A R61#2.2
NetEL1_2: EL1.2(K) R48.1
NetEL1_3: EL1.3(E) R50.2
NetEL2_2: EL2.2(K) R52.1
NetEL2_3: EL2.3(E) R54.2
NetEL3_2: EL3.2(K) R56#2.1
NetEL3_3: EL3.3(E) R58#2.2
NetEL4_2: EL4.2(K) R60#2.1
NetEL4_3: EL4.3(E) R62#2.2
NetQ1#2_1: Q1#2.1(B) R50.1 R51.1
NetQ2_1: Q2.1(B) R54.1 R55.1
NetQ3_1: Q3.1(B) R58#2.1 R59#2.1
NetQ4_1: Q4.1(B) R62#2.1 R63#2.1

### Notes on the sheet
- 输入/?

### Library data of the parts
D17 D19 D21 D23 = DIODE
D18#2 D20 D22 D24 = 0: 发光二极管; ComponentLink1Description: 供应商链接; ComponentLink1URL: http://www.szlcsc.com/product/details_2659.html; Package: 0603; Supplier: LC; SuppliersPartNumber: C2286
EL1-EL4 = ST188: 反射式光电传感器; Published: 24-Mar-1999; LatestRevisionDate: 04-Mar-2005; LatestRevisionNote: Sch pins 3 & 4 Swapped.; DatasheetDocument: Nov-2003; PackageReference: DIP-4; Publisher: Altium Limited
JZC_OUT2#1 JZC_OUT2#2 JZC_OUT3#1 JZC_OUT3#2 = Header 2: Header, 2-Pin; LatestRevisionDate: 17-Jul-2002; LatestRevisionNote: Re-released for DXP Platform.; Publisher: Altium Limited
P14 = Header: 接插件; LatestRevisionDate: 17-Jul-2002; LatestRevisionNote: Re-released for DXP Platform.; Publisher: Altium Limited
R48-R55 R56#2 R57#2 R58#2 R59#2 R60#2 R61#2 R62#2 R63#2 = Res2: Resistor; Published: 8-Jun-2000; LatestRevisionDate: 17-Jul-2002; LatestRevisionNote: Re-released for DXP Platform.; PackageReference: AXIAL-0.4; Publisher: Altium Limited
  R48 R49 R52 R53 R56#2 R57#2 R60#2 R61#2: Value: 1K
  R50 R54 R58#2 R62#2: Value: 2K
  R51 R55 R59#2 R63#2: Value: 10K

## Sheet POWER.SchDoc
size A4
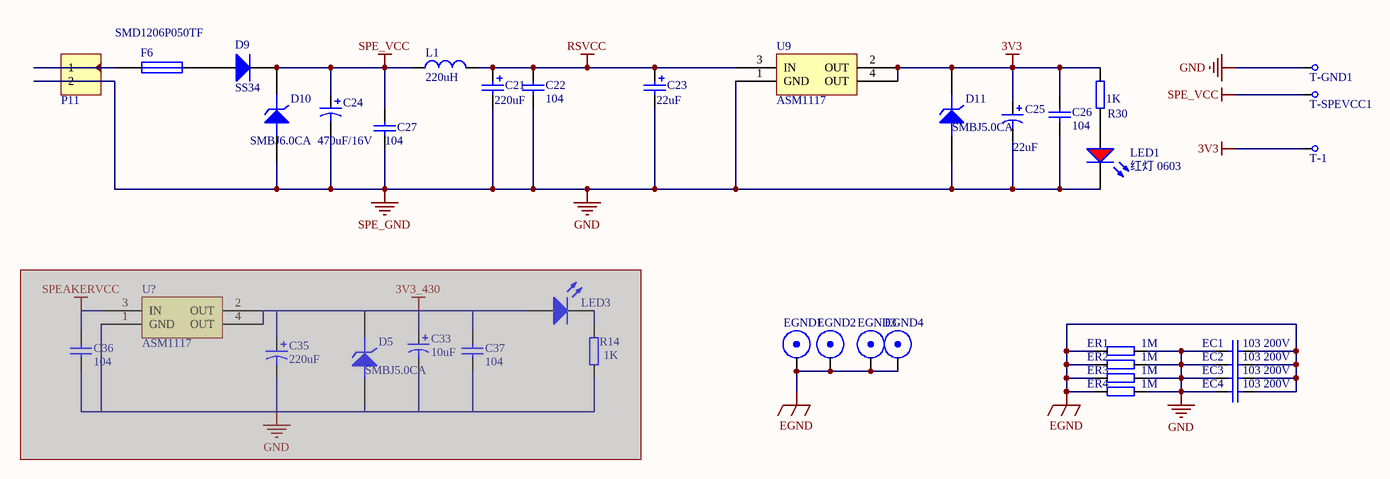
[diagram p7: POWER.SchDoc]

### Parts
(Parts that share a designator on the sheet are numbered #1, #2 ... from top to bottom, then left to right.)
C21#2  220uF  [C-RB-SD8]
C22#2  104  [LC-0603_C]
C23#3  22uF  [C-RB-SD6]
C24#3  470uF/16V  [C-RB-SD8]
C25#2  22uF  [HONOR_63X54]
C26#2  104  [LC-0603_C]
C27#2  104  [LC-0603_C]
C33#2  10uF  [HONOR_63X54]  (masked out: inside a compile mask, not in the netlist)
C35#2  220uF  [C-RB-SD8]  (masked out: inside a compile mask, not in the netlist)
C36#2  104  [LC-0603_C]  (masked out: inside a compile mask, not in the netlist)
C37#2  104  [LC-0603_C]  (masked out: inside a compile mask, not in the netlist)
D5#2  SMBJ5.0CA  [LC-SMB(DO-214AA)_S1]  (masked out: inside a compile mask, not in the netlist)
D9#2  SS34  [LC-SMA(DO-214AC)_S5]
D10  SMBJ6.0CA  [LC-SMB(DO-214AA)_S1]
D11  SMBJ5.0CA  [LC-SMB(DO-214AA)_S1]
EC1  103 200V  [LC-1206_C]
EC2  103 200V  [LC-1206_C]
EC3  103 200V  [LC-1206_C]
EC4  103 200V  [LC-1206_C]
EGND1  EGND  [H-6-3.2m]  (value not drawn)
EGND2  EGND  [H-6-3.2m]  (value not drawn)
EGND3  EGND  [H-6-3.2m]  (value not drawn)
EGND4  EGND  [H-6-3.2m]  (value not drawn)
ER1  1M  [LC-1206_R]
ER2  1M  [LC-1206_R]
ER3  1M  [LC-1206_R]
ER4  1M  [LC-1206_R]
F6  SMD1206P050TF  [LC-1206_R]
L1  value 220uH  [L-SMD-7]  (hidden comment: Inductor)
LED1  红灯 0603  [LC-0603_LED_S1]
LED3  LED0  [LC-0603_LED_S1]  (value not drawn)  (masked out: inside a compile mask, not in the netlist)
P11  Header 2  [D5.08-2P]  (value not drawn)
R14#2  1K  [LC-0603_R]  (masked out: inside a compile mask, not in the netlist)
R30#2  1K  [LC-0603_R]
T-1  CHECK  [CHECK-B]  (value not drawn)
T-GND1  CHECK  [CHECK-B]  (value not drawn)
T-SPEVCC1  CHECK  [CHECK-B]  (value not drawn)
U9  ASM1117  [SOT223]
U?  ASM1117  [SOT223]  (masked out: inside a compile mask, not in the netlist)

### Nets
3V3: C25#2.1 C26#2.2 D11.2(K) R30#2.2 T-1.1 U9.2(OUT) U9.4(OUT)
EGND: EC1.1 EC2.1 EC3.1 EC4.1 EGND1.0 EGND2.0 EGND3.0 EGND4.0 ER1.1 ER2.1 ER3.1 ER4.1
GND: C21#2.2 C22#2.1 C23#3.2 C24#3.2 C25#2.2 C26#2.1 C27#2.2 D10.1(A) D11.1(A) EC1.2 EC2.2 EC3.2 EC4.2 ER1.2 ER2.2 ER3.2 ER4.2 LED1.K P11.2 T-GND1.1 U9.1(GND)  [also labelled SPE_GND]
RSVCC: C21#2.1 C22#2.2 C23#3.1 L1.2 U9.3(IN)
SPE_VCC: C24#3.1 C27#2.1 D9#2.2(K) D10.2(K) L1.1 T-SPEVCC1.1  [project net JZC_VCC]
NetD9#2_1: D9#2.1(A) F6.2
NetF6_1: F6.1 P11.1
NetLED1_A: LED1.A R30#2.1

### Library data of the parts
C21#2 = Cap Pol1: Polarized Capacitor (Radial); Value: 22uF; Published: 8-Jun-2000; Revision: July-2002: Re-released for DXP Platform.; Publisher: Altium Limited
C22#2 C26#2 C36#2 C37#2 = Cap: Capacitor; Published: 8-Jun-2000; LatestRevisionDate: 17-Jul-2002; LatestRevisionNote: Re-released for DXP Platform.; PackageReference: RAD-0.3; Publisher: Altium Limited; Value: 104
C23#3 = Cap Pol1: Polarized Capacitor (Radial); Published: 8-Jun-2000; Revision: July-2002: Re-released for DXP Platform.; Publisher: Altium Limited; Value: 22uF
C24#3 = Cap Pol3: Polarized Capacitor (Surface Mount); Value: 470uF; Published: 8-Jun-2000; LatestRevisionDate: 17-Jul-2002; LatestRevisionNote: Re-released for DXP Platform.; PackageReference: C0805; Publisher: Altium Limited
C25#2 = Cap Pol3: Polarized Capacitor (Surface Mount); Value: 10uF; Published: 8-Jun-2000; LatestRevisionDate: 17-Jul-2002; LatestRevisionNote: Re-released for DXP Platform.; PackageReference: C0805; Publisher: Altium Limited
C27#2 = Cap: Capacitor; Value: 100nF; Published: 8-Jun-2000; Revision: July-2002: Re-released for DXP Platform.; Publisher: Altium Limited
C33#2 C35#2 = Cap Pol3: Polarized Capacitor (Surface Mount); Published: 8-Jun-2000; LatestRevisionDate: 17-Jul-2002; LatestRevisionNote: Re-released for DXP Platform.; PackageReference: C0805; Publisher: Altium Limited
  C33#2: Value: 10uF
  C35#2: Value: 220uF
D5#2 D10 D11 = ZENER3: Zener Diode
D9#2 = Diode: Default Diode; Published: 8-Jun-2000; LatestRevisionDate: 17-Jul-2002; LatestRevisionNote: Re-released for DXP Platform.; PackageDocument: Sep-1996; PackageReference: SMC; Publisher: Altium Limited; Code_JEDEC: DO-214-AB
EC1-EC4 = Cap: Capacitor; Value: 103; Published: 8-Jun-2000; Revision: July-2002: Re-released for DXP Platform.; Publisher: Altium Limited
ER1-ER4 R14#2 R30#2 = RES2
F6 = Fuse 1: Fuse; Published: 8-Jun-2000; LatestRevisionDate: 17-Jul-2002; LatestRevisionNote: Re-released for DXP Platform.; PackageReference: PIN-W2/E2.8; Publisher: Altium Limited
L1 = Inducto: 电感; Code_IEC: 1005; Published: 8-Jun-2000; LatestRevisionDate: 17-Jul-2002; LatestRevisionNote: Re-released for DXP Platform.; PackageReference: 0402-A; Publisher: Altium Limited; Code_JEITA: 0402
LED1 = 0: 发光二极管; ComponentLink1Description: 供应商链接; ComponentLink1URL: http://www.szlcsc.com/product/details_2659.html; Package: 0603; Supplier: LC; SuppliersPartNumber: C2286
LED3 = LED0: Typical INFRARED GaAs LED; Published: 8-Jun-2000; LatestRevisionDate: 08-Jul-2005; LatestRevisionNote: Mech Layer 1 removed.; PackageReference: LED-0; Publisher: Altium Limited
P11 = Head: 接插件; LatestRevisionDate: 17-Jul-2002; LatestRevisionNote: Re-released for DXP Platform.; Publisher: Altium Limited
T-1 T-GND1 T-SPEVCC1 = CHE: 测试点
U9 U? = ASM1: 3.3V稳压芯片

## Nets that join several sheets
3V3: STM32F407VXX (30 pins), W5500 (P13.10 R47.1), FOUR-INPORT (R3.2 R9.2 R16.2 R23.2), RS485 (ADuM1.1 C29#1.2 N1.1), KT403A1 (P2#2.2 R29#2.1), TWO_OUTPORT (EL1.1 EL2.1 EL3.1 EL4.1), POWER (7 pins)
GND: STM32F407VXX (33 pins), W5500 (P13.8), FOUR-INPORT (12 pins), LED-12PORT (68 pins), RS485 (9 pins), KT403A1 (P2#2.9), TWO_OUTPORT (8 pins), POWER (21 pins)
JZC_VCC: FOUR-INPORT (F1.1), LED-12PORT (12 pins), RS485 (7 pins), KT403A1 (P2#2.7), TWO_OUTPORT (16 pins), POWER (6 pins)
/INT: STM32F407VXX (MCU1.46), W5500 (P13.2)
/RESET: STM32F407VXX (MCU1.45), W5500 (P13.4)
/SPI_SCS: STM32F407VXX (MCU1.51), W5500 (P13.1)
CON_IO1: STM32F407VXX (MCU1.33), KT403A1 (P2#2.4)
CON_IO2: STM32F407VXX (MCU1.34), KT403A1 (P2#2.6)
CON_IO3: STM32F407VXX (MCU1.35), KT403A1 (P2#2.8)
CON_IO4: STM32F407VXX (MCU1.36), KT403A1 (P2#2.10)
InternetRST: STM32F407VXX (MCU1.55), W5500 (P13.6)
KM1: STM32F407VXX (MCU1.15), TWO_OUTPORT (R48.2)
KM2: STM32F407VXX (MCU1.16), TWO_OUTPORT (R52.2)
KM3: STM32F407VXX (MCU1.17), TWO_OUTPORT (R56#2.2)
KM4: STM32F407VXX (MCU1.18), TWO_OUTPORT (R60#2.2)
KT603_TEST: STM32F407VXX (MCU1.24), KT403A1 (P2#2.1 R29#2.2)
LEDA: STM32F407VXX (MCU1.71), LED-12PORT (U5#1.6)
LEDB: STM32F407VXX (MCU1.77), LED-12PORT (U5#1.5)
LEDC: STM32F407VXX (MCU1.78), LED-12PORT (U5#1.4)
LEDCLK: STM32F407VXX (MCU1.79), LED-12PORT (U5#1.3)
LEDD: STM32F407VXX (MCU1.86), LED-12PORT (U7.4)
LEDLAT: STM32F407VXX (MCU1.80), LED-12PORT (U5#1.2)
MP3_RX: STM32F407VXX (MCU1.25), KT403A1 (P2#2.3)
MP3_TX: STM32F407VXX (MCU1.26), KT403A1 (P2#2.5)
PA0: STM32F407VXX (MCU1.23), FOUR-INPORT (C15.1 R23.1 U4.4)
PA9: STM32F407VXX (MCU1.68), RS485 (ADuM1.3)
PA10: STM32F407VXX (MCU1.69), RS485 (ADuM1.2)
PA11: STM32F407VXX (MCU1.70), LED-12PORT (U5#1.7)
PB3: STM32F407VXX (MCU1.89), LED-12PORT (U6.9)
PB4: STM32F407VXX (MCU1.90), LED-12PORT (U6.8)
PB5: STM32F407VXX (MCU1.91), LED-12PORT (U6.7)
PB6: STM32F407VXX (MCU1.92), LED-12PORT (U6.6)
PB7: STM32F407VXX (MCU1.93), LED-12PORT (U6.5)
PB8: STM32F407VXX (MCU1.95), LED-12PORT (U6.4)
PB9: STM32F407VXX (MCU1.96), LED-12PORT (U6.3)
PB13: STM32F407VXX (MCU1.52), W5500 (P13.7)
PB14: STM32F407VXX (MCU1.53), W5500 (P13.5)
PB15: STM32F407VXX (MCU1.54), W5500 (P13.3)
PC8: STM32F407VXX (MCU1.65), LED-12PORT (U5#1.9)
PC9: STM32F407VXX (MCU1.66), LED-12PORT (U5#1.8)
PD0: STM32F407VXX (MCU1.81), LED-12PORT (U7.9)
PD1: STM32F407VXX (MCU1.82), LED-12PORT (U7.8)
PD2: STM32F407VXX (MCU1.83), LED-12PORT (U7.7)
PD3: STM32F407VXX (MCU1.84), LED-12PORT (U7.6)
PD4: STM32F407VXX (MCU1.85), LED-12PORT (U7.5)
PD6: STM32F407VXX (MCU1.87), LED-12PORT (U7.3)
PD7: STM32F407VXX (MCU1.88), LED-12PORT (U7.2)
PD8_W5500_TEST: STM32F407VXX (MCU1.56), W5500 (P13.9 R47.2)
PE0: STM32F407VXX (MCU1.97), LED-12PORT (U6.2)
PE1: STM32F407VXX (MCU1.98), LED-12PORT (U8.7)
PE2: STM32F407VXX (MCU1.1), LED-12PORT (U8.6)
PE3: STM32F407VXX (MCU1.2), LED-12PORT (U8.5)
PE4: STM32F407VXX (MCU1.3), LED-12PORT (U8.4)
PE5: STM32F407VXX (MCU1.4), LED-12PORT (U8.3)
PE6: STM32F407VXX (MCU1.5), LED-12PORT (U8.2)
PE8: STM32F407VXX (MCU1.39), RS485 (R34#1.1)
PE9: STM32F407VXX (MCU1.40), FOUR-INPORT (C11#1.1 R16.1 U3.4)
PE11: STM32F407VXX (MCU1.42), FOUR-INPORT (C5.1 R9.1 U2.4)
PE13: STM32F407VXX (MCU1.44), FOUR-INPORT (C4.1 R3.1 U1.4)